# EAGLE schematic A20-OLinuXino-Lime_Rev_J (EAGLE 4.16)
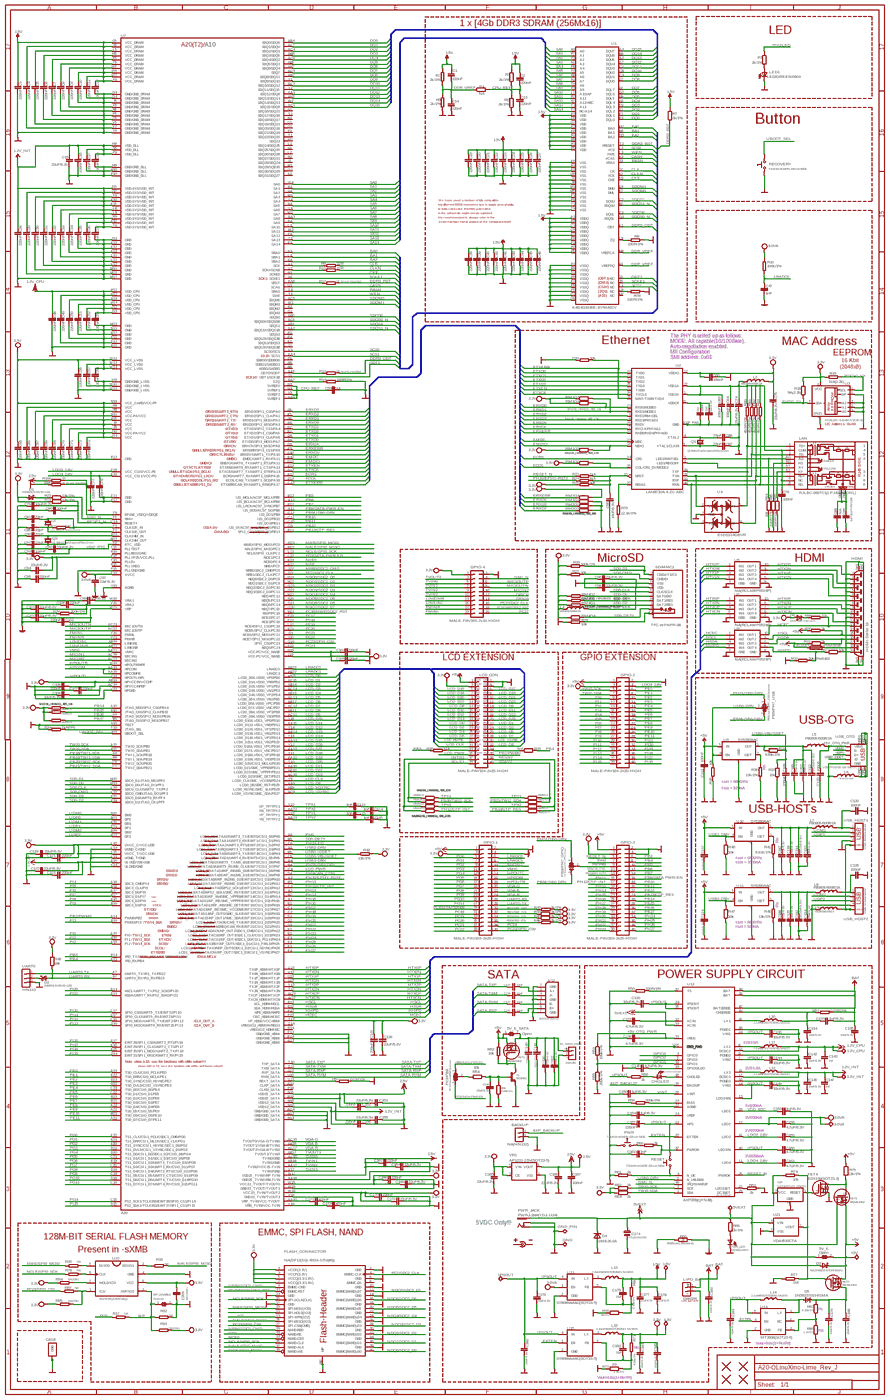
[diagram p0: schematic, sheet 1, overview]
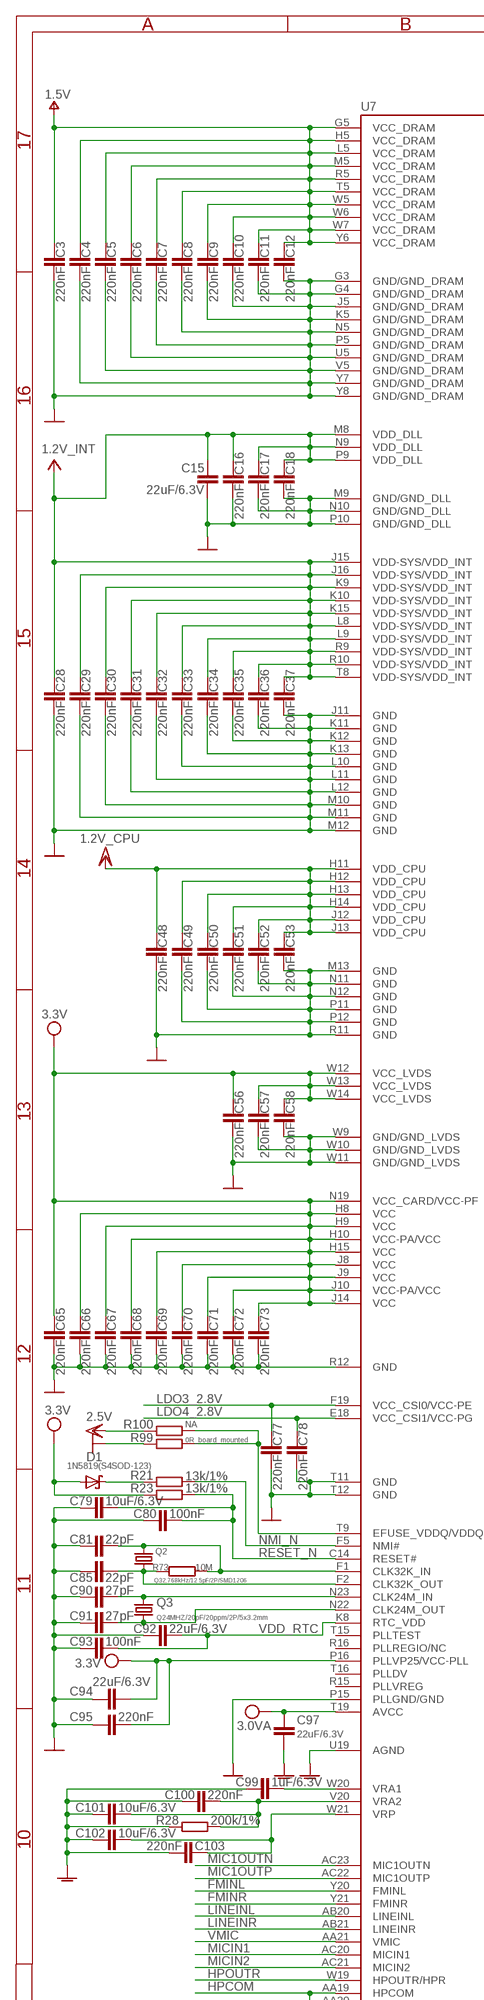
[diagram p1: schematic, sheet 1, part 1 of 4]
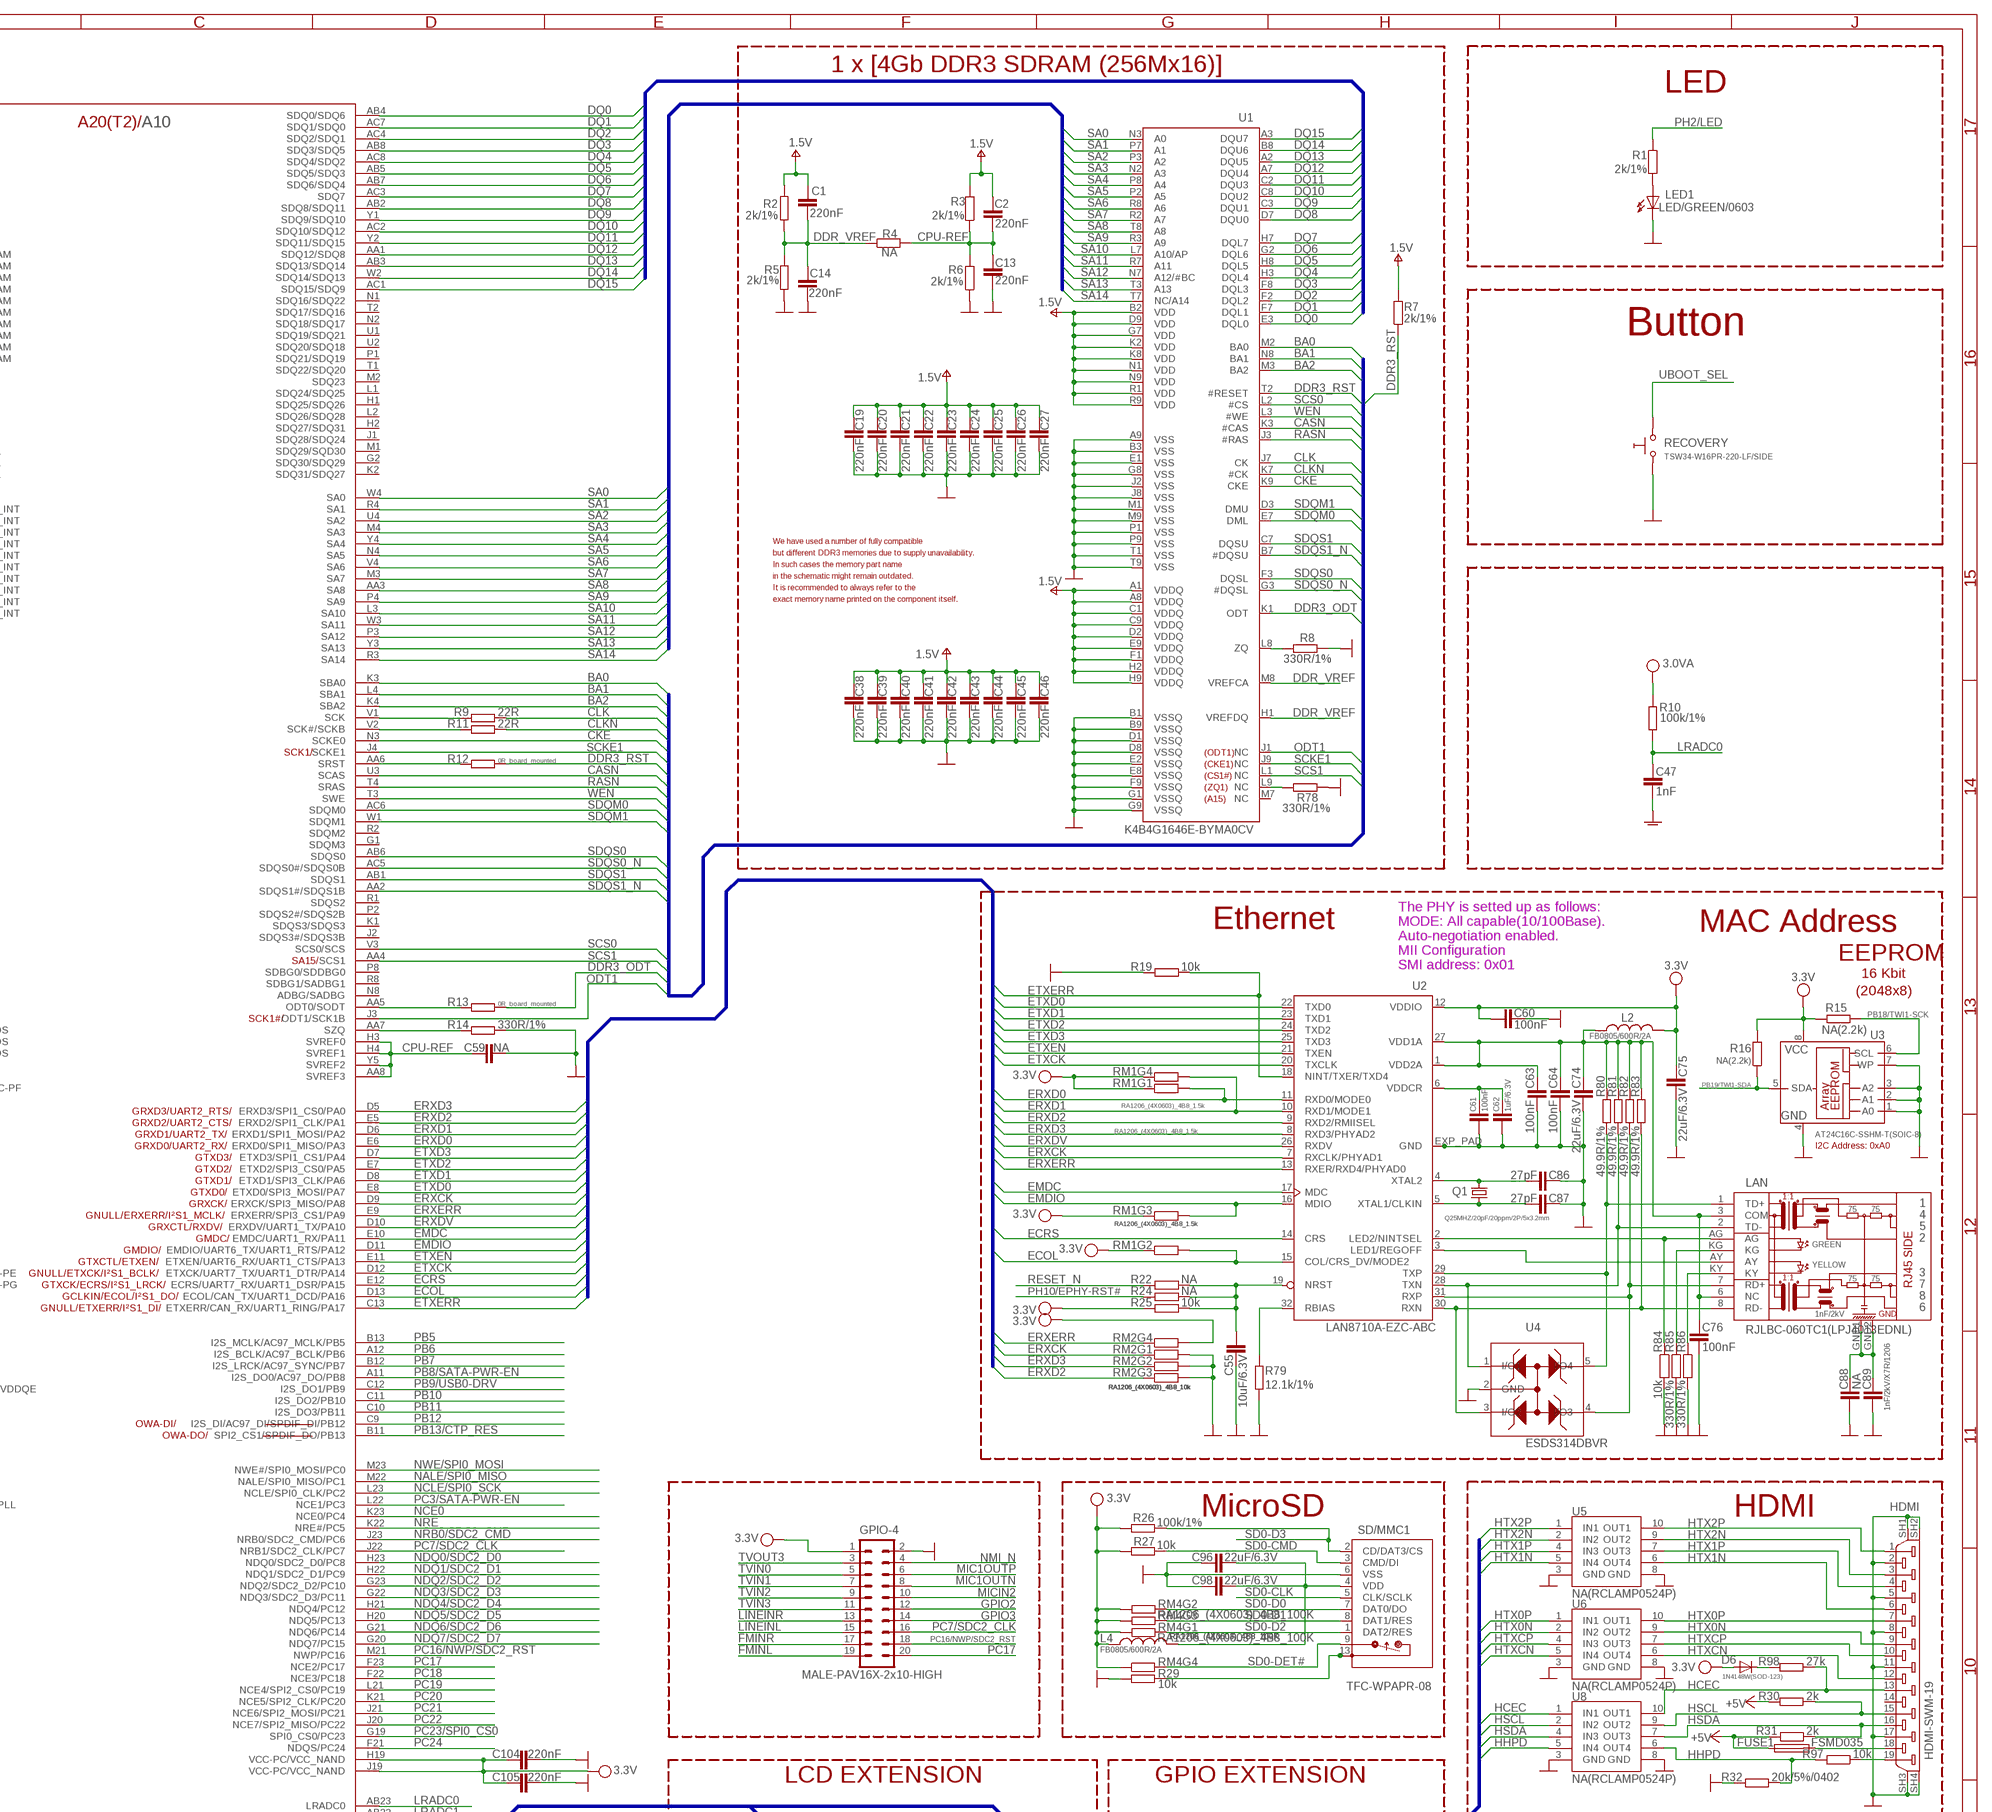
[diagram p2: schematic, sheet 1, part 2 of 4]
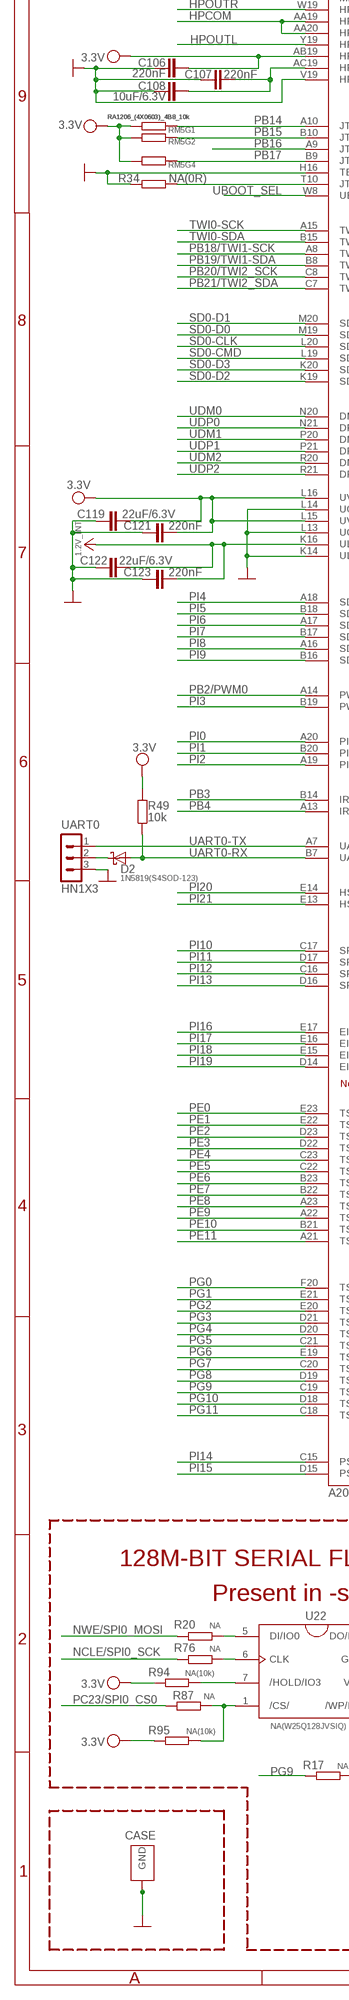
[diagram p3: schematic, sheet 1, part 3 of 4]
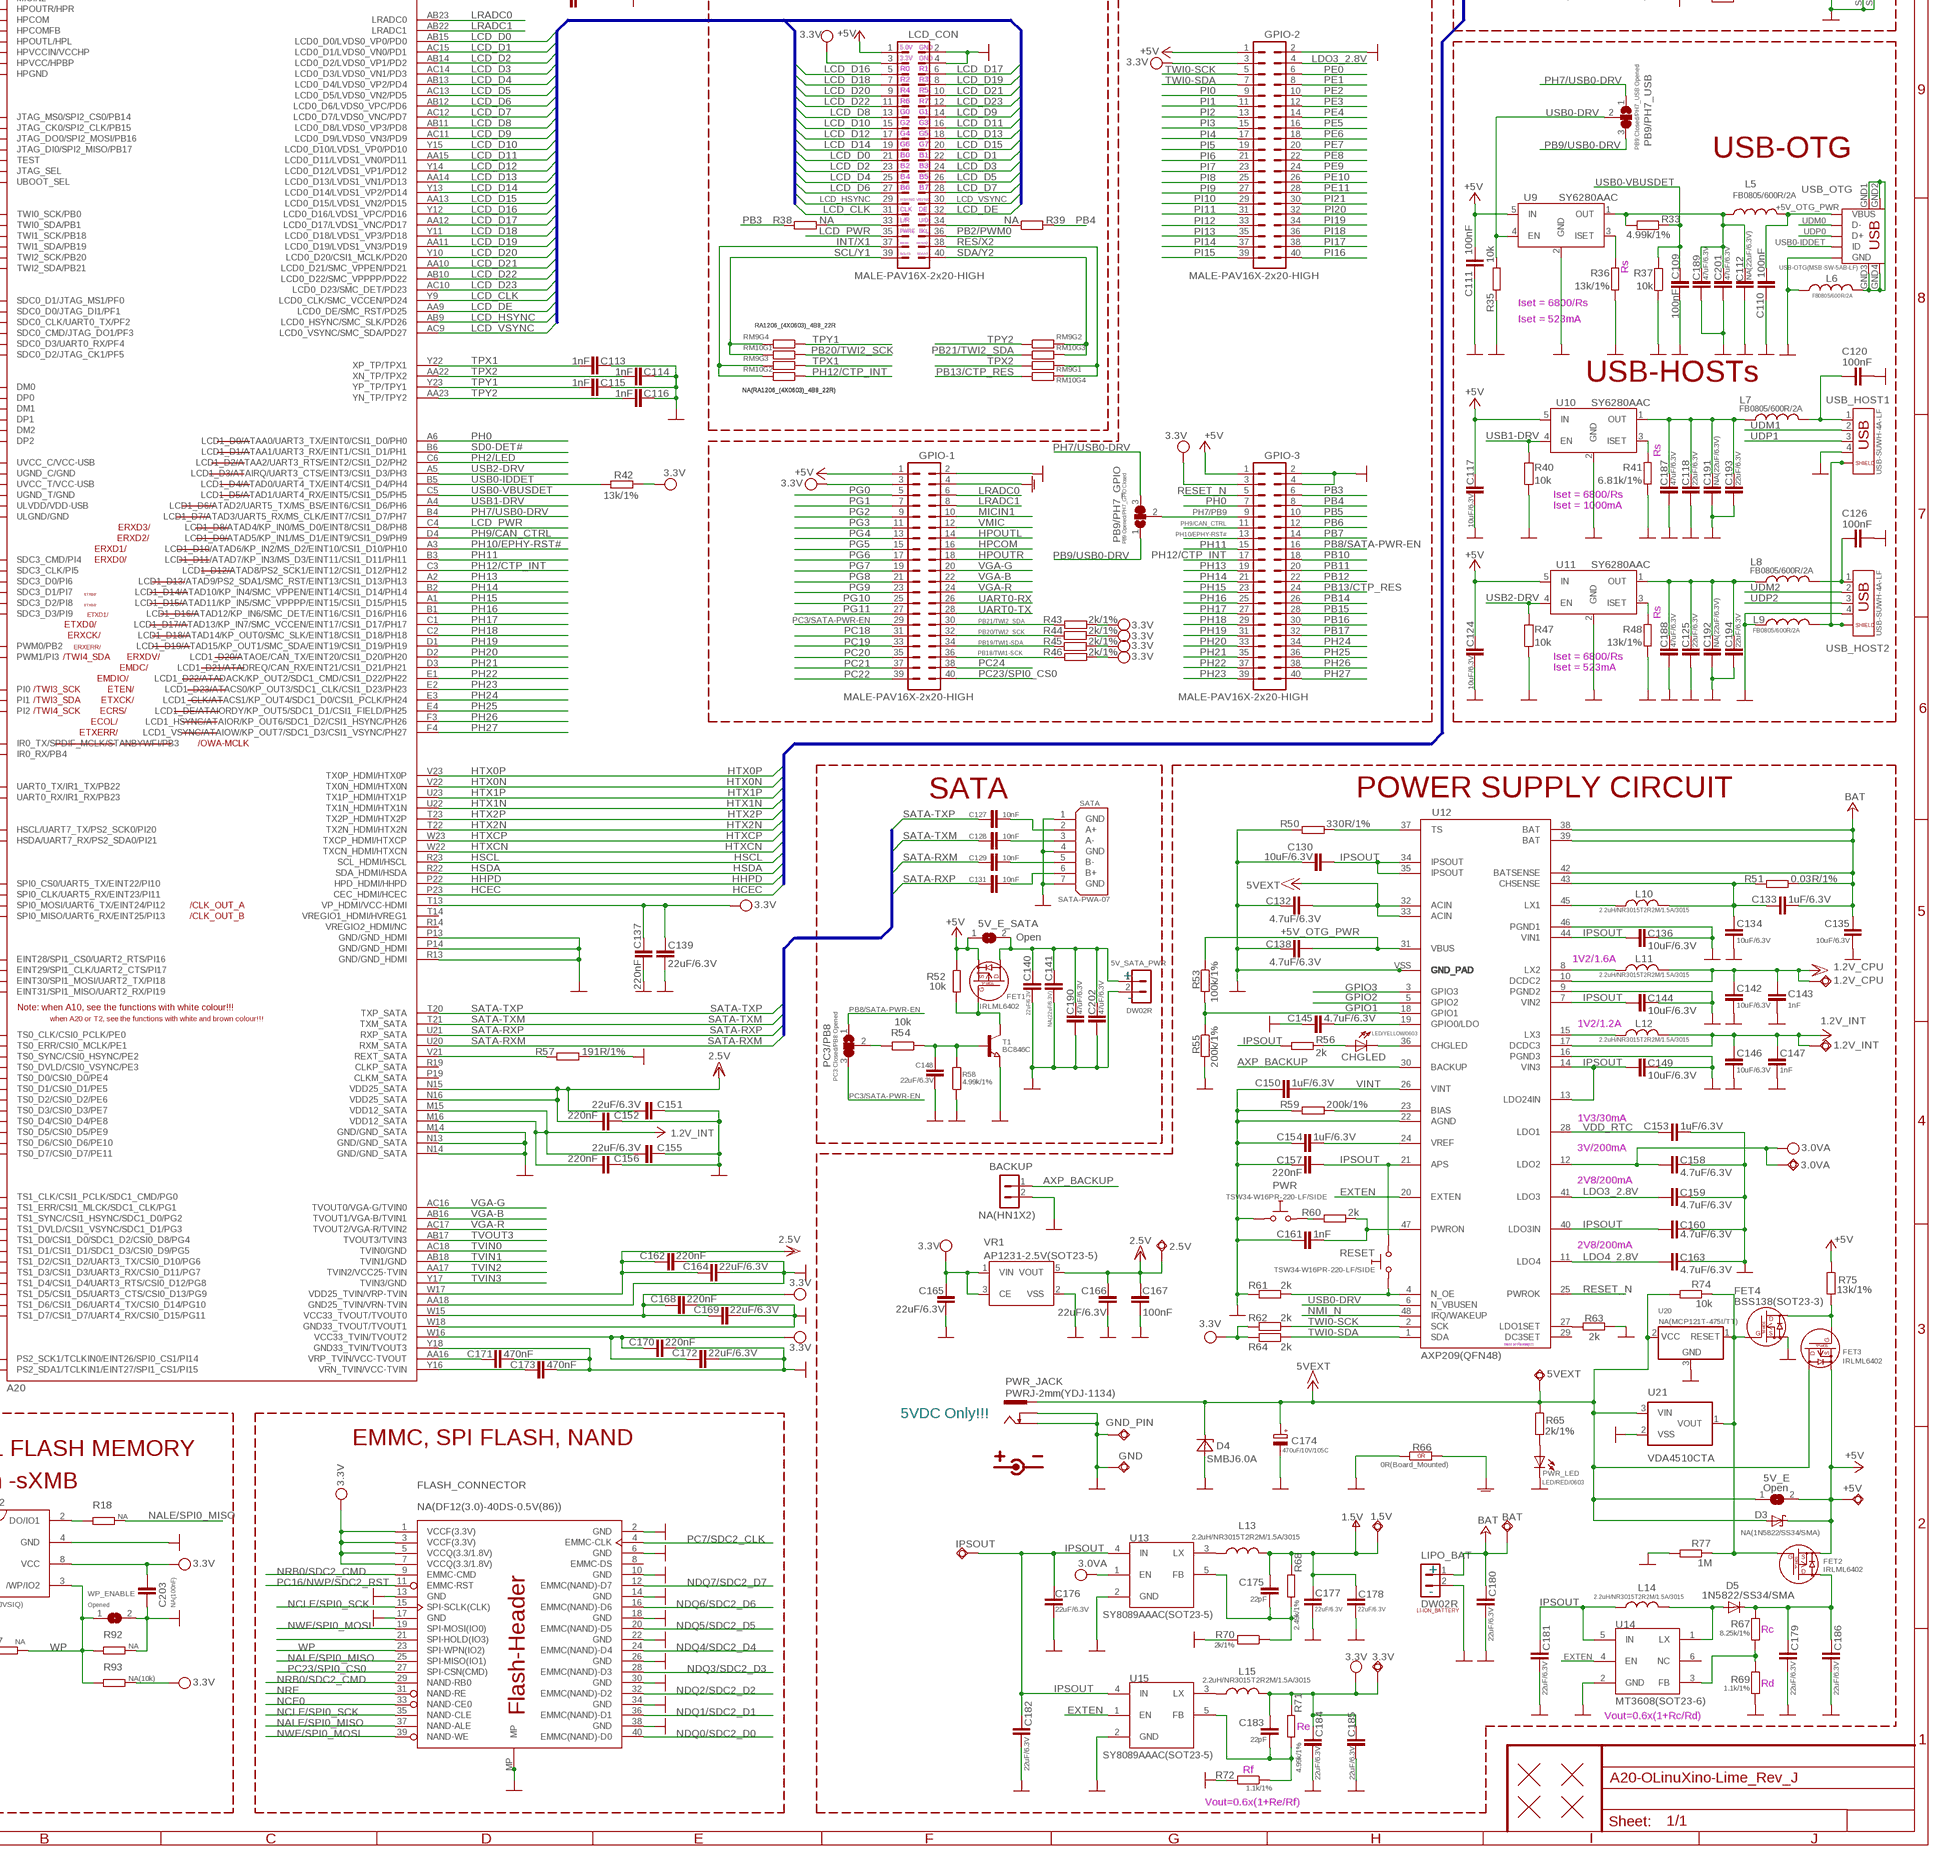
[diagram p4: schematic, sheet 1, part 4 of 4]

## Parts
1.2V_CPU  TESTPADTESTPAD_40-ROUND  [TESTPAD_40-ROUND]
1.2V_INT  TESTPADTESTPAD_40-ROUND  [TESTPAD_40-ROUND]
1.5V  TESTPADTESTPAD_40-ROUND  [TESTPAD_40-ROUND]
2.5V  TESTPADTESTPAD_40-ROUND  [TESTPAD_40-ROUND]
3.0VA  TESTPADTESTPAD_40-ROUND  [TESTPAD_40-ROUND]
3.3V  TESTPADTESTPAD_40-ROUND  [TESTPAD_40-ROUND]
5V_E  Open  SJSJ_SMALLER  [SJ_1_SMALLER]
5V_E_SATA  Open  SJSJ_SMALLER  [SJ_1_SMALLER]
5V_SATA_PWR  DW02R  CON2DW02R  [DW02R]
5VEXT  TESTPADTESTPAD_40-ROUND  [TESTPAD_40-ROUND]
+5V  TESTPADTESTPAD_40-ROUND  [TESTPAD_40-ROUND]
BACKUP  NA(HN1X2)  CON2HN1X2  [HN1X2]
BAT  TESTPADTESTPAD_40-ROUND  [TESTPAD_40-ROUND]
C1  220nF  C-EUC0402_TI  [C0402_TI]
C2  220nF  C-EUC0402_TI  [C0402_TI]
C3  220nF  C-EUC0402_TI  [C0402_TI]
C4  220nF  C-EUC0402_TI  [C0402_TI]
C5  220nF  C-EUC0402_TI  [C0402_TI]
C6  220nF  C-EUC0402_TI  [C0402_TI]
C7  220nF  C-EUC0402_TI  [C0402_TI]
C8  220nF  C-EUC0402_TI  [C0402_TI]
C9  220nF  C-EUC0402_TI  [C0402_TI]
C10  220nF  C-EUC0402_TI  [C0402_TI]
C11  220nF  C-EUC0402_TI  [C0402_TI]
C12  220nF  C-EUC0402_TI  [C0402_TI]
C13  220nF  C-EUC0402_TI  [C0402_TI]
C14  220nF  C-EUC0402_TI  [C0402_TI]
C15  22uF/6.3V  C-EUC0603_DWS  [C0603_DWS]
C16  220nF  C-EUC0402_TI  [C0402_TI]
C17  220nF  C-EUC0402_TI  [C0402_TI]
C18  220nF  C-EUC0402_TI  [C0402_TI]
C19  220nF  C-EUC0402_TI  [C0402_TI]
C20  220nF  C-EUC0402_TI  [C0402_TI]
C21  220nF  C-EUC0402_TI  [C0402_TI]
C22  220nF  C-EUC0402_TI  [C0402_TI]
C23  220nF  C-EUC0402_TI  [C0402_TI]
C24  220nF  C-EUC0402_TI  [C0402_TI]
C25  220nF  C-EUC0402_TI  [C0402_TI]
C26  220nF  C-EUC0402_TI  [C0402_TI]
C27  220nF  C-EUC0402_TI  [C0402_TI]
C28  220nF  C-EUC0402_TI  [C0402_TI]
C29  220nF  C-EUC0402_TI  [C0402_TI]
C30  220nF  C-EUC0402_TI  [C0402_TI]
C31  220nF  C-EUC0402_TI  [C0402_TI]
C32  220nF  C-EUC0402_TI  [C0402_TI]
C33  220nF  C-EUC0402_TI  [C0402_TI]
C34  220nF  C-EUC0402_TI  [C0402_TI]
C35  220nF  C-EUC0402_TI  [C0402_TI]
C36  220nF  C-EUC0402_TI  [C0402_TI]
C37  220nF  C-EUC0402_TI  [C0402_TI]
C38  220nF  C-EUC0402_TI  [C0402_TI]
C39  220nF  C-EUC0402_TI  [C0402_TI]
C40  220nF  C-EUC0402_TI  [C0402_TI]
C41  220nF  C-EUC0402_TI  [C0402_TI]
C42  220nF  C-EUC0402_TI  [C0402_TI]
C43  220nF  C-EUC0402_TI  [C0402_TI]
C44  220nF  C-EUC0402_TI  [C0402_TI]
C45  220nF  C-EUC0402_TI  [C0402_TI]
C46  220nF  C-EUC0402_TI  [C0402_TI]
C47  1nF  C-EUC0402_TI  [C0402_TI]
C48  220nF  C-EUC0402_TI  [C0402_TI]
C49  220nF  C-EUC0402_TI  [C0402_TI]
C50  220nF  C-EUC0402_TI  [C0402_TI]
C51  220nF  C-EUC0402_TI  [C0402_TI]
C52  220nF  C-EUC0402_TI  [C0402_TI]
C53  220nF  C-EUC0402_TI  [C0402_TI]
C55  10uF/6.3V  C-EUC0603_DWS  [C0603_DWS]
C56  220nF  C-EUC0402_TI  [C0402_TI]
C57  220nF  C-EUC0402_TI  [C0402_TI]
C58  220nF  C-EUC0402_TI  [C0402_TI]
C59  NA  C-EUC0603_DWS  [C0603_DWS]
C60  100nF  C-EUC0402_TI  [C0402_TI]
C61  100nF  C-EUC0402_TI  [C0402_TI]
C62  1uF/6.3V  C-EUC0603_DWS  [C0603_DWS]
C63  100nF  C-EUC0402_TI  [C0402_TI]
C64  100nF  C-EUC0402_TI  [C0402_TI]
C65  220nF  C-EUC0402_TI  [C0402_TI]
C66  220nF  C-EUC0402_TI  [C0402_TI]
C67  220nF  C-EUC0402_TI  [C0402_TI]
C68  220nF  C-EUC0402_TI  [C0402_TI]
C69  220nF  C-EUC0402_TI  [C0402_TI]
C70  220nF  C-EUC0402_TI  [C0402_TI]
C71  220nF  C-EUC0402_TI  [C0402_TI]
C72  220nF  C-EUC0402_TI  [C0402_TI]
C73  220nF  C-EUC0402_TI  [C0402_TI]
C74  22uF/6.3V  C-EUC0603_DWS  [C0603_DWS]
C75  22uF/6.3V  C-EUC0603_DWS  [C0603_DWS]
C76  100nF  C-EUC0402_TI  [C0402_TI]
C77  220nF  C-EUC0402_TI  [C0402_TI]
C78  220nF  C-EUC0402_TI  [C0402_TI]
C79  10uF/6.3V  C-EUC0603_DWS  [C0603_DWS]
C80  100nF  C-EUC0402_TI  [C0402_TI]
C81  22pF  C-EUC0603_DWS  [C0603_DWS]
C85  22pF  C-EUC0603_DWS  [C0603_DWS]
C86  27pF  C-EUC0402_TI  [C0402_TI]
C87  27pF  C-EUC0402_TI  [C0402_TI]
C88  NA  C-EUC1206_5MILS_WS_ISO  [C1206_5MILS_WS_ISO]
C89  1nF/2kV/X7R/1206  C-EUC1206_5MILS_WS_ISO  [C1206_5MILS_WS_ISO]
C90  27pF  C-EUC0402_TI  [C0402_TI]
C91  27pF  C-EUC0402_TI  [C0402_TI]
C92  22uF/6.3V  C-EUC0603_DWS  [C0603_DWS]
C93  100nF  C-EUC0402_TI  [C0402_TI]
C94  22uF/6.3V  C-EUC0603_DWS  [C0603_DWS]
C95  220nF  C-EUC0402_TI  [C0402_TI]
C96  22uF/6.3V  C-EUC0603_DWS  [C0603_DWS]
C97  22uF/6.3V  C-EUC0603_DWS  [C0603_DWS]
C98  22uF/6.3V  C-EUC0603_DWS  [C0603_DWS]
C99  1uF/6.3V  C-EUC0603_DWS  [C0603_DWS]
C100  220nF  C-EUC0402_TI  [C0402_TI]
C101  10uF/6.3V  C-EUC0603_DWS  [C0603_DWS]
C102  10uF/6.3V  C-EUC0603_DWS  [C0603_DWS]
C103  220nF  C-EUC0402_TI  [C0402_TI]
C104  220nF  C-EUC0402_TI  [C0402_TI]
C105  220nF  C-EUC0402_TI  [C0402_TI]
C106  220nF  C-EUC0402_TI  [C0402_TI]
C107  220nF  C-EUC0402_TI  [C0402_TI]
C108  10uF/6.3V  C-EUC0603_DWS  [C0603_DWS]
C109  100nF  C-EUC0402_TI  [C0402_TI]
C110  100nF  C-EUC0402_TI  [C0402_TI]
C111  100nF  C-EUC0402_TI  [C0402_TI]
C112  NA(22uF/6.3V)  C-EUC0603_DWS  [C0603_DWS]
C113  1nF  C-EUC0402_TI  [C0402_TI]
C114  1nF  C-EUC0402_TI  [C0402_TI]
C115  1nF  C-EUC0402_TI  [C0402_TI]
C116  1nF  C-EUC0402_TI  [C0402_TI]
C117  10uF/6.3V  C-EUC0603_DWS  [C0603_DWS]
C118  22uF/6.3V  C-EUC0603_DWS  [C0603_DWS]
C119  22uF/6.3V  C-EUC0603_DWS  [C0603_DWS]
C120  100nF  C-EUC0402_TI  [C0402_TI]
C121  220nF  C-EUC0402_TI  [C0402_TI]
C122  22uF/6.3V  C-EUC0603_DWS  [C0603_DWS]
C123  220nF  C-EUC0402_TI  [C0402_TI]
C124  10uF/6.3V  C-EUC0603_DWS  [C0603_DWS]
C125  22uF/6.3V  C-EUC0603_DWS  [C0603_DWS]
C126  100nF  C-EUC0402_TI  [C0402_TI]
C127  10nF  C-EUC0402_TI  [C0402_TI]
C128  10nF  C-EUC0402_TI  [C0402_TI]
C129  10nF  C-EUC0402_TI  [C0402_TI]
C130  10uF/6.3V  C-EUC0603_DWS  [C0603_DWS]
C131  10nF  C-EUC0402_TI  [C0402_TI]
C132  4.7uF/6.3V  C-EUC0603_DWS  [C0603_DWS]
C133  1uF/6.3V  C-EUC0603_DWS  [C0603_DWS]
C134  10uF/6.3V  C-EUC0603_DWS  [C0603_DWS]
C135  10uF/6.3V  C-EUC0603_DWS  [C0603_DWS]
C136  10uF/6.3V  C-EUC0603_DWS  [C0603_DWS]
C137  220nF  C-EUC0402_TI  [C0402_TI]
C138  4.7uF/6.3V  C-EUC0603_DWS  [C0603_DWS]
C139  22uF/6.3V  C-EUC0603_DWS  [C0603_DWS]
C140  22uF/6.3V  C-EUC0603_DWS  [C0603_DWS]
C141  NA(22uF/6.3V)  C-EUC0603_DWS  [C0603_DWS]
C142  10uF/6.3V  C-EUC0603_DWS  [C0603_DWS]
C143  1nF  C-EUC0402_TI  [C0402_TI]
C144  10uF/6.3V  C-EUC0603_DWS  [C0603_DWS]
C145  4.7uF/6.3V  C-EUC0603_DWS  [C0603_DWS]
C146  10uF/6.3V  C-EUC0603_DWS  [C0603_DWS]
C147  1nF  C-EUC0402_TI  [C0402_TI]
C148  22uF/6.3V  C-EUC0603_DWS  [C0603_DWS]
C149  10uF/6.3V  C-EUC0603_DWS  [C0603_DWS]
C150  1uF/6.3V  C-EUC0603_DWS  [C0603_DWS]
C151  22uF/6.3V  C-EUC0603_DWS  [C0603_DWS]
C152  220nF  C-EUC0402_TI  [C0402_TI]
C153  1uF/6.3V  C-EUC0603_DWS  [C0603_DWS]
C154  1uF/6.3V  C-EUC0603_DWS  [C0603_DWS]
C155  22uF/6.3V  C-EUC0603_DWS  [C0603_DWS]
C156  220nF  C-EUC0402_TI  [C0402_TI]
C157  220nF  C-EUC0402_TI  [C0402_TI]
C158  4.7uF/6.3V  C-EUC0603_DWS  [C0603_DWS]
C159  4.7uF/6.3V  C-EUC0603_DWS  [C0603_DWS]
C160  4.7uF/6.3V  C-EUC0603_DWS  [C0603_DWS]
C161  1nF  C-EUC0402_TI  [C0402_TI]
C162  220nF  C-EUC0402_TI  [C0402_TI]
C163  4.7uF/6.3V  C-EUC0603_DWS  [C0603_DWS]
C164  22uF/6.3V  C-EUC0603_DWS  [C0603_DWS]
C165  22uF/6.3V  C-EUC0603_DWS  [C0603_DWS]
C166  22uF/6.3V  C-EUC0603_DWS  [C0603_DWS]
C167  100nF  C-EUC0402_TI  [C0402_TI]
C168  220nF  C-EUC0402_TI  [C0402_TI]
C169  22uF/6.3V  C-EUC0603_DWS  [C0603_DWS]
C170  220nF  C-EUC0402_TI  [C0402_TI]
C171  470nF  C-EUC0603_DWS  [C0603_DWS]
C172  22uF/6.3V  C-EUC0603_DWS  [C0603_DWS]
C173  470nF  C-EUC0603_DWS  [C0603_DWS]
C174  470uF/10V/105C  CPOL-EUE2.5-6.3  [E2,5-6,3]
C175  22pF  C-EUC0603_DWS  [C0603_DWS]
C176  22uF/6.3V  C-EUC0603_DWS  [C0603_DWS]
C177  22uF/6.3V  C-EUC0603_DWS  [C0603_DWS]
C178  22uF/6.3V  C-EUC0603_DWS  [C0603_DWS]
C179  22uF/6.3V  C-EUC0603_DWS  [C0603_DWS]
C180  22uF/6.3V  C-EUC0603_DWS  [C0603_DWS]
C181  22uF/6.3V  C-EUC0603_DWS  [C0603_DWS]
C182  22uF/6.3V  C-EUC0603_DWS  [C0603_DWS]
C183  22pF  C-EUC0603_DWS  [C0603_DWS]
C184  22uF/6.3V  C-EUC0603_DWS  [C0603_DWS]
C185  22uF/6.3V  C-EUC0603_DWS  [C0603_DWS]
C186  22uF/6.3V  C-EUC0603_DWS  [C0603_DWS]
C187  47uF/6.3V  C-EUC0805_5MIL_D  [C0805_5MIL_D]
C188  47uF/6.3V  C-EUC0805_5MIL_D  [C0805_5MIL_D]
C189  47uF/6.3V  C-EUC0805_5MIL_D  [C0805_5MIL_D]
C190  47uF/6.3V  C-EUC0805_5MIL_D  [C0805_5MIL_D]
C191  NA(22uF/6.3V)  C-EUC0603_DWS  [C0603_DWS]
C192  NA(22uF/6.3V)  C-EUC0603_DWS  [C0603_DWS]
C193  22uF/6.3V  C-EUC0603_DWS  [C0603_DWS]
C194  22uF/6.3V  C-EUC0603_DWS  [C0603_DWS]
C201  47uF/6.3V  C-EUC0805_5MIL_D  [C0805_5MIL_D]
C202  47uF/6.3V  C-EUC0805_5MIL_D  [C0805_5MIL_D]
C203  NA(100nF)  C-EUC0402_TI  [C0402_TI]
CASE  CASE_HAMMOND_1593LBK-1  [HAMMOND_1593LBK_A10_LIME_NO_MILLING]
CHGLED  LED/YELLOW/0603  LEDLED-0603_TEST  [LED-0603_TEST]
D1  1N5819(S4SOD-123)  SCHOTKKY7.62SS-1N5819(S4SOD-123)  [SOD-123]
D2  1N5819(S4SOD-123)  SCHOTKKY7.62SS-1N5819(S4SOD-123)  [SOD-123]
D3  NA(1N5822/SS34/SMA)  SCHOTKKY7.62SS2  [MLL-41]
D4  SMBJ6.0A  SMBJ16A  [DO214AA]
D5  1N5822/SS34/SMA  D-MLL-41  [MELF-MLL41]
D6  1N4148W(SOD-123)  DSMD  [MINI-MELF]
FET1  IRLML6402  P-MOS+DIODIRLML6402  [SOT23]
FET2  IRLML6402  P-MOS+DIODIRLML6402  [SOT23]
FET3  IRLML6402  P-MOS+DIODIRLML6402  [SOT23]
FET4  BSS138(SOT23-3)  N-MOS+DIODBSS138(SOT23-3)  [SOT23]
FLASH_CONNECTOR  NA(DF12(3.0)-40DS-0.5V(86))  FLASH_CON[DF12(3.0)-40DS-0.5V(86)]  [FLASH_CON[DF12(3.0)-40DS-0.5V(86)]]
FUSE1  FSMD035  FUSE  [1206]
GND  TESTPADTESTPAD_40-ROUND  [TESTPAD_40-ROUND]
GND_PIN  TESTPAD3  [TEST_PAD40/70/SQUARE]
GPIO-1  MALE-PAV16X-2x20-HIGH  ML40YA-V36P-2X20-LF  [YA-V36P-2X20-LF]
GPIO-2  MALE-PAV16X-2x20-HIGH  ML40YA-V36P-2X20-LF  [YA-V36P-2X20-LF]
GPIO-3  MALE-PAV16X-2x20-HIGH  ML40YA-V36P-2X20-LF  [YA-V36P-2X20-LF]
GPIO-4  MALE-PAV16X-2x10-HIGH  ML20YA-V36P-2X10-LF  [YA-V36P-2X10-LF]
HDMI  HDMI-SWM-19  HDMI-MC34931HDMI-SWM-19-OLD  [HDMI-SWM-19-OLD]
IPSOUT  TESTPADTESTPAD_40-ROUND  [TESTPAD_40-ROUND]
L2  FB0805/600R/2A  L-USL0805_5MIL_DWS  [L0805_5MIL_DWS]
L4  FB0805/600R/2A  L-USL0805_5MIL_DWS  [L0805_5MIL_DWS]
L5  FB0805/600R/2A  L-USL0805_5MIL_DWS  [L0805_5MIL_DWS]
L6  FB0805/600R/2A  L-USL0805_5MIL_DWS  [L0805_5MIL_DWS]
L7  FB0805/600R/2A  L-USL0805_5MIL_DWS  [L0805_5MIL_DWS]
L8  FB0805/600R/2A  L-USL0805_5MIL_DWS  [L0805_5MIL_DWS]
L9  FB0805/600R/2A  L-USL0805_5MIL_DWS  [L0805_5MIL_DWS]
L10  2.2uH/NR3015T2R2M/1.5A/3015  L-CD32  [CD32]
L11  2.2uH/NR3015T2R2M/1.5A/3015  L-CD32  [CD32]
L12  2.2uH/NR3015T2R2M/1.5A/3015  L-CD32  [CD32]
L13  2.2uH/NR3015T2R2M/1.5A/3015  L-CD32  [CD32]
L14  2.2uH/NR3015T2R2M/1.5A/3015  L-CD32  [CD32]
L15  2.2uH/NR3015T2R2M/1.5A/3015  L-CD32  [CD32]
LAN  RJLBC-060TC1(LPJ4013EDNL)  RJLBC-060TC1_GND_MILLING  [RJLBC-060TC1_MILLING]
LCD_CON  MALE-PAV16X-2x20-HIGH  ML40YA-V36P-2X20-LF  [YA-V36P-2X20-LF]
LED1  LED/GREEN/0603  LEDLED-0603_TEST  [LED-0603_TEST]
LIPO_BAT  DW02R  CON2DW02R  [DW02R]
PB9/PH7_GPIO  PB9:Opened/PH7_GPIO:Closed  SJ2W5  [SJ_2_SMALL_23_TIED]
PB9/PH7_USB  PB9:Closed/PH7_USB:Opened  SJ2W5  [SJ_2_SMALL_23_TIED]
PC3/PB8  PC3:Closed/PB8:Opened  SJ2W5  [SJ_2_SMALL_23_TIED]
PWR  TSW34-W16PR-220-LF/SIDE  SW-TAKTSIDE_WTCM-TR(3X4)  [SW_TAKT3X4]
PWR_JACK  PWRJ-2mm(YDJ-1134)  PWR-JAKPWR_JACK_UNI_MILLING  [PWR_JACK_UNI_MILLING]
PWR_LED  LED/RED/0603  LEDLED-0603_TEST  [LED-0603_TEST]
Q1  Q25MHZ/20pF/20ppm/2P/5x3.2mm  HC49/STEST  [HCX-4S_TEST]
Q2  Q32.768kHz/12.5pF/2P/SMD1206  MC-306_MC-306-TEST  [MC-306_TEST]
Q3  Q24MHZ/20pF/20ppm/2P/5x3.2mm  HC49/STEST  [HCX-4S_TEST]
R1  2k/1%  R-EU_R0603_5MIL_DWS  [R0603_5MIL_DWS]
R2  2k/1%  R-EU_R0603_5MIL_DWS  [R0603_5MIL_DWS]
R3  2k/1%  R-EU_R0603_5MIL_DWS  [R0603_5MIL_DWS]
R4  NA  R-EU_R0603_5MIL_DWS  [R0603_5MIL_DWS]
R5  2k/1%  R-EU_R0603_5MIL_DWS  [R0603_5MIL_DWS]
R6  2k/1%  R-EU_R0603_5MIL_DWS  [R0603_5MIL_DWS]
R7  2k/1%  R-EU_R0603_5MIL_DWS  [R0603_5MIL_DWS]
R8  330R/1%  R-EU_R0603_5MIL_DWS  [R0603_5MIL_DWS]
R9  22R  R-EU_R0402_TI  [R0402_TI]
R10  100k/1%  R-EU_R0603_5MIL_DWS  [R0603_5MIL_DWS]
R11  22R  R-EU_R0402_TI  [R0402_TI]
R12  0R_board_mounted  R-EU_R0402_TI_0R  [R0402_TI_0R]
R13  0R_board_mounted  R-EU_R0402_TI_0R  [R0402_TI_0R]
R14  330R/1%  R-EU_R0603_5MIL_DWS  [R0603_5MIL_DWS]
R15  NA(2.2k)  R-EU_R0603_5MIL_DWS  [R0603_5MIL_DWS]
R16  NA(2.2k)  R-EU_R0603_5MIL_DWS  [R0603_5MIL_DWS]
R17  NA  R-EU_R0402_TI  [R0402_TI]
R18  NA  R-EU_R0402_TI  [R0402_TI]
R19  10k  R-EU_R0402_TI  [R0402_TI]
R20  NA  R-EU_R0402_TI  [R0402_TI]
R21  13k/1%  R-EU_R0603_5MIL_DWS  [R0603_5MIL_DWS]
R22  NA  R-EU_R0402_TI  [R0402_TI]
R23  13k/1%  R-EU_R0603_5MIL_DWS  [R0603_5MIL_DWS]
R24  NA  R-EU_R0402_TI  [R0402_TI]
R25  10k  R-EU_R0402_TI  [R0402_TI]
R26  100k/1%  R-EU_R0603_5MIL_DWS  [R0603_5MIL_DWS]
R27  10k  R-EU_R0402_TI  [R0402_TI]
R28  200k/1%  R-EU_R0603_5MIL_DWS  [R0603_5MIL_DWS]
R29  10k  R-EU_R0402_TI  [R0402_TI]
R30  2k  R-EU_R0402_TI  [R0402_TI]
R31  2k  R-EU_R0402_TI  [R0402_TI]
R32  20k/5%/0402  R-EU_R0402_TI  [R0402_TI]
R33  4.99k/1%  R-EU_R0603_5MIL_DWS  [R0603_5MIL_DWS]
R34  NA(0R)  R-EU_R0603_5MIL_DWS  [R0603_5MIL_DWS]
R35  10k  R-EU_R0402_TI  [R0402_TI]
R36  13k/1%  R-EU_R0603_5MIL_DWS  [R0603_5MIL_DWS]
R37  10k  R-EU_R0402_TI  [R0402_TI]
R38  NA  R-EU_R0603_5MIL_DWS  [R0603_5MIL_DWS]
R39  NA  R-EU_R0603_5MIL_DWS  [R0603_5MIL_DWS]
R40  10k  R-EU_R0402_TI  [R0402_TI]
R41  6.81k/1%  R-EU_R0603_5MIL_DWS  [R0603_5MIL_DWS]
R42  13k/1%  R-EU_R0603_5MIL_DWS  [R0603_5MIL_DWS]
R43  2k/1%  R-EU_R0603_5MIL_DWS  [R0603_5MIL_DWS]
R44  2k/1%  R-EU_R0603_5MIL_DWS  [R0603_5MIL_DWS]
R45  2k/1%  R-EU_R0603_5MIL_DWS  [R0603_5MIL_DWS]
R46  2k/1%  R-EU_R0603_5MIL_DWS  [R0603_5MIL_DWS]
R47  10k  R-EU_R0402_TI  [R0402_TI]
R48  13k/1%  R-EU_R0603_5MIL_DWS  [R0603_5MIL_DWS]
R49  10k  R-EU_R0402_TI  [R0402_TI]
R50  330R/1%  R-EU_R0603_5MIL_DWS  [R0603_5MIL_DWS]
R51  0.03R/1%  R-EU_R1206_5MIL_WS  [R1206_5MIL_WS]
R52  10k  R-EU_R0402_TI  [R0402_TI]
R53  100k/1%  R-EU_R0603_5MIL_DWS  [R0603_5MIL_DWS]
R54  10k  R-EU_R0402_TI  [R0402_TI]
R55  200k/1%  R-EU_R0603_5MIL_DWS  [R0603_5MIL_DWS]
R56  2k  R-EU_R0402_TI  [R0402_TI]
R57  191R/1%  R-EU_R0603_5MIL_DWS  [R0603_5MIL_DWS]
R58  4.99k/1%  R-EU_R0603_5MIL_DWS  [R0603_5MIL_DWS]
R59  200k/1%  R-EU_R0603_5MIL_DWS  [R0603_5MIL_DWS]
R60  2k  R-EU_R0402_TI  [R0402_TI]
R61  2k  R-EU_R0402_TI  [R0402_TI]
R62  2k  R-EU_R0402_TI  [R0402_TI]
R63  2k  R-EU_R0402_TI  [R0402_TI]
R64  2k  R-EU_R0402_TI  [R0402_TI]
R65  2k/1%  R-EU_R0603_5MIL_DWS  [R0603_5MIL_DWS]
R66  0R(Board_Mounted)  R_0R0R(NA)  [0603_0R]
R67  8.25k/1%  R-EU_R0603_5MIL_DWS  [R0603_5MIL_DWS]
R68  2.49k/1%  R-EU_R0603_5MIL_DWS  [R0603_5MIL_DWS]
R69  1.1k/1%  R-EU_R0603_5MIL_DWS  [R0603_5MIL_DWS]
R70  2k/1%  R-EU_R0603_5MIL_DWS  [R0603_5MIL_DWS]
R71  4.99k/1%  R-EU_R0603_5MIL_DWS  [R0603_5MIL_DWS]
R72  1.1k/1%  R-EU_R0603_5MIL_DWS  [R0603_5MIL_DWS]
R73  10M  R-EU_R0402_TI  [R0402_TI]
R74  10k  R-EU_R0402_TI  [R0402_TI]
R75  13k/1%  R-EU_R0603_5MIL_DWS  [R0603_5MIL_DWS]
R76  NA  R-EU_R0402_TI  [R0402_TI]
R77  1M  R-EU_R0402_TI  [R0402_TI]
R78  330R/1%  R-EU_R0603_5MIL_DWS  [R0603_5MIL_DWS]
R79  12.1k/1%  R-EU_R0603_5MIL_DWS  [R0603_5MIL_DWS]
R80  49.9R/1%  R-EU_R0402_TI  [R0402_TI]
R81  49.9R/1%  R-EU_R0402_TI  [R0402_TI]
R82  49.9R/1%  R-EU_R0402_TI  [R0402_TI]
R83  49.9R/1%  R-EU_R0402_TI  [R0402_TI]
R84  10k  R-EU_R0402_TI  [R0402_TI]
R85  330R/1%  R-EU_R0603_5MIL_DWS  [R0603_5MIL_DWS]
R86  330R/1%  R-EU_R0603_5MIL_DWS  [R0603_5MIL_DWS]
R87  NA  R-EU_R0402_TI  [R0402_TI]
R92  NA  R-EU_R0402_TI  [R0402_TI]
R93  NA(10k)  R-EU_R0402_TI  [R0402_TI]
R94  NA(10k)  R-EU_R0402_TI  [R0402_TI]
R95  NA(10k)  R-EU_R0402_TI  [R0402_TI]
R97  10k  R-EU_R0402_TI  [R0402_TI]
R98  27k  R-EU_R0402_TI  [R0402_TI]
R99  0R_board_mounted  R-EU_R0402_TI_0R  [R0402_TI_0R]
R100  NA  R-EU_R0402_TI  [R0402_TI]
RECOVERY  TSW34-W16PR-220-LF/SIDE  SW-TAKTSIDE_WTCM-TR(3X4)  [SW_TAKT3X4]
RESET  TSW34-W16PR-220-LF/SIDE  SW-TAKTSIDE_WTCM-TR(3X4)  [SW_TAKT3X4]
RM1  RA1206_(4X0603)_4B8_1.5k  R_MATRIX_4E  [R_MATRIX_4]
RM2  RA1206_(4X0603)_4B8_10k  R_MATRIX_4E  [R_MATRIX_4]
RM4  RA1206_(4X0603)_4B8_100K  R_MATRIX_4E  [R_MATRIX_4]
RM5  RA1206_(4X0603)_4B8_10k  R_MATRIX_4E  [R_MATRIX_4]
RM9  RA1206_(4X0603)_4B8_22R  R_MATRIX_4E  [R_MATRIX_4]
RM10  NA(RA1206_(4X0603)_4B8_22R)  R_MATRIX_4E  [R_MATRIX_4]
SATA  SATA-PWA-07  SATA-PWA-07"  [SATA-PWA-07]
SD/MMC1  TFC-WPAPR-08  MICRO_SD/MMC_CP_NEWTFC-WPAPR-08  [TFC-WPAPR-08]
T1  BC846C  NPN-TRANSISTOR_SOT23  [SOT23]
U1  K4B4G1646E-BYMA0CV  H5TQ2G63BFR_MEM4G16D3EABG-125PHIS  [FBGA96_MEM]
U2  LAN8710A-EZC-ABC  LAN8710A-EZC  [QFN-32(DRILLS)]
U3  AT24C16C-SSHM-T(SOIC-8)  24LCXX  [SO-08MN]
U4  ESDS314DBVR  [SOT23-5]
U5  NA(RCLAMP0524P)  RCLAMP0524PTEST  [SLP2510P8_TEST]
U6  NA(RCLAMP0524P)  RCLAMP0524PTEST  [SLP2510P8_TEST]
U7  A20  A10  [TFBGA441]
U8  NA(RCLAMP0524P)  RCLAMP0524PTEST  [SLP2510P8_TEST]
U9  SY6280AAC  SY6280  [SOT23-5]
U10  SY6280AAC  SY6280  [SOT23-5]
U11  SY6280AAC  SY6280  [SOT23-5]
U12  AXP209(QFN48)  AXP209  [QFN48]
U13  SY8089AAAC(SOT23-5)  SY8008  [SOT23-5]
U14  MT3608(SOT23-6)  SY7208  [SOT23-6]
U15  SY8089AAAC(SOT23-5)  SY8008  [SOT23-5]
U16  FIDUCIAL  [FIDUCIAL-1X3]
U17  FIDUCIAL  [FIDUCIAL-1X3]
U18  FIDUCIAL  [FIDUCIAL-1X3]
U19  FIDUCIAL  [FIDUCIAL-1X3]
U20  NA(MCP121T-475I/TT)  RESETMCP130T-300-I/TT  [SOT23]
U21  VDA4510CTA  VDA2710NTA  [SOT-23]
U22  NA(W25Q128JVSIQ)  W25Q16BVSSIG(SO-8)  [SO-8-BIG]
UART0  HN1X3  CON3HN1X3  [HN1X3]
USB_HOST1  USB-SUWH-4A-LF  USB_SHIELDUSB_A_VERTICAL  [USB_A_VERTICAL_PTH]
USB_HOST2  USB-SUWH-4A-LF  USB_SHIELDUSB_A_VERTICAL  [USB_A_VERTICAL_PTH]
USB_OTG  USB-OTG(MSB-SW-5AB-LF)  MINI_USB9-USB-OTG(MSB-SW-5AB-LF)  [USB_MINI_9PIN-SD]
VR1  AP1231-2.5V(SOT23-5)  AP1231-33  [SOT-23-5]
WP_ENABLE  Opened  SJSJ_SMALLER  [SJ_1_SMALLER]

## Nets
+5V: 5V_E.2 5V_E_SATA.1 +5V.1(PP) C111.1 C117.1 C124.1 D3.K(C) FET1.2(S) FET2.2(S) FET3.2(S) FUSE1.1 GPIO-1.1 GPIO-2.1 GPIO-3.1 LCD_CON.1 R30.2 R31.2 R52.1 R75.1 U9.5(IN) U10.5(IN) U11.5(IN)
+5V_OTG_PWR: C110.1 C138.2 L5.1 R53.1 U12.31(VBUS) USB_OTG.VBUS
+15V: 5V_E.1 5VEXT.1(PP) C132.2 C174.+ D3.A D4.C FET3.3(D) PWR_JACK.+ R65.1 R74.1 U12.32(ACIN) U12.33(ACIN) U20.2(VCC) U21.3(VIN) ; supply symbol labelled 5VEXT
+24V: BAT.1(PP) C133.2 C135.1 C180.2 LIPO_BAT.1 R51.2 U12.38(BAT) U12.39(BAT) U12.42(BATSENSE) ; supply symbol labelled BAT
AXP_BACKUP: BACKUP.1 U12.30(BACKUP)
BA0: U1.M2(BA0) U7.K3(SBA0)
BA1: U1.N8(BA1) U7.L4(SBA1)
BA2: U1.M3(BA2) U7.K4(SBA2)
CASN: U1.K3(#CAS) U7.U3(SCAS)
CHASSIS [PWR]: C88.2 C89.2 LAN.GND1 LAN.GND2
CKE: U1.K9(CKE) U7.N3(SCKE0)
CLK: R9.1 U1.J7(CK)
CLKN: R11.1 U1.K7(#CK)
CPU-REF: C2.2 C13.2 C59.2 R3.1 R4.2 R6.2 U7.AA8(SVREF3) U7.H3(SVREF0) U7.H4(SVREF1) U7.Y5(SVREF2)
DDR3_ODT: R13.1 U1.K1(ODT)
DDR3_RST: R7.1 R12.1 U1.T2(#RESET)
DDR_VREF: C1.2 C14.2 R2.1 R4.1 R5.2 U1.H1(VREFDQ) U1.M8(VREFCA)
DQ0: U1.E3(DQL0) U7.AB4(SDQ0/SDQ6)
DQ1: U1.F7(DQL1) U7.AC7(SDQ1/SDQ0)
DQ2: U1.F2(DQL2) U7.AC4(SDQ2/SDQ1)
DQ3: U1.F8(DQL3) U7.AB8(SDQ3/SDQ5)
DQ4: U1.H3(DQL4) U7.AC8(SDQ4/SDQ2)
DQ5: U1.H8(DQL5) U7.AB5(SDQ5/SDQ3)
DQ6: U1.G2(DQL6) U7.AB7(SDQ6/SDQ4)
DQ7: U1.H7(DQL7) U7.AC3(SDQ7)
DQ8: U1.D7(DQU0) U7.AB2(SDQ8/SDQ11)
DQ9: U1.C3(DQU1) U7.Y1(SDQ9/SDQ10)
DQ10: U1.C8(DQU2) U7.AC2(SDQ10/SDQ12)
DQ11: U1.C2(DQU3) U7.Y2(SDQ11/SDQ15)
DQ12: U1.A7(DQU4) U7.AA1(SDQ12/SDQ8)
DQ13: U1.A2(DQU5) U7.AB3(SDQ13/SDQ14)
DQ14: U1.B8(DQU6) U7.W2(SDQ14/SDQ13)
DQ15: U1.A3(DQU7) U7.AC1(SDQ15/SDQ9)
ECOL: RM1.2.2 U2.15(COL/CRS_DV/MODE2) U7.D13(ECOL/CAN_TX/UART1_DCD/PA16)
ECRS: U2.14(CRS) U7.E12(ECRS/UART7_RX/UART1_DSR/PA15)
EMDC: U2.17(MDC) U7.E10(EMDC/UART1_RX/PA11)
EMDIO: RM1.3.2 U2.16(MDIO) U7.D11(EMDIO/UART6_TX/UART1_RTS/PA12)
ERXCK: RM2.1.1 U2.7(RXCLK/PHYAD1) U7.D9(ERXCK/SPI3_MISO/PA8)
ERXD0: RM1.1.2 U2.11(RXD0/MODE0) U7.E6(ERXD0/SPI1_MISO/PA3)
ERXD1: RM1.4.2 U2.10(RXD1/MODE1) U7.D6(ERXD1/SPI1_MOSI/PA2)
ERXD2: RM2.3.1 U2.9(RXD2/RMIISEL) U7.E5(ERXD2/SPI1_CLK/PA1)
ERXD3: RM2.2.1 U2.8(RXD3/PHYAD2) U7.D5(ERXD3/SPI1_CS0/PA0)
ERXDV: U2.26(RXDV) U7.D10(ERXDV/UART1_TX/PA10)
ERXERR: RM2.4.1 U2.13(RXER/RXD4/PHYAD0) U7.E9(ERXERR/SPI3_CS1/PA9)
ETHERNET_VDD: C63.2 C64.2 C74.2 C76.2 L2.1 LAN.3(COM) LAN.6(NC) R80.2 R81.2 R82.2 R83.2 U2.1(VDD2A) U2.27(VDD1A)
ETXCK: U2.20(TXCLK) U7.D12(ETXCK/UART7_TX/UART1_DTR/PA14)
ETXD0: U2.22(TXD0) U7.E8(ETXD0/SPI3_MOSI/PA7)
ETXD1: U2.23(TXD1) U7.D8(ETXD1/SPI3_CLK/PA6)
ETXD2: U2.24(TXD2) U7.E7(ETXD2/SPI3_CS0/PA5)
ETXD3: U2.25(TXD3) U7.D7(ETXD3/SPI1_CS1/PA4)
ETXEN: U2.21(TXEN) U7.E11(ETXEN/UART6_RX/UART1_CTS/PA13)
ETXERR: R19.2 U2.18(NINT/TXER/TXD4) U7.C13(ETXERR/CAN_RX/UART1_RING/PA17)
EXTEN: U12.20(EXTEN) U14.4(EN) U15.1(EN)
FMINL: GPIO-4.19 U7.Y20(FMINL)
FMINR: GPIO-4.17 U7.Y21(FMINR)
GND [PWR]: 5V_SATA_PWR.2 BACKUP.2 C3.1 C4.1 C5.1 C6.1 C7.1 C8.1 C9.1 C10.1 C11.1 C12.1 C13.1 C14.1 C15.1 C16.1 C17.1 C18.1 C19.1 C20.1 C21.1 C22.1 C23.1 C24.1 C25.1 C26.1 C27.1 C28.1 C29.1 C30.1 C31.1 C32.1 C33.1 C34.1 C35.1 C36.1 C37.1 C38.1 C39.1 C40.1 C41.1 C42.1 C43.1 C44.1 C45.1 C46.1 C48.1 C49.1 C50.1 C51.1 C52.1 C53.1 C55.1 C56.1 C57.1 C58.1 C59.1 C60.1 C61.1 C62.1 C63.1 C64.1 C65.1 C66.1 C67.1 C68.1 C69.1 C70.1 C71.1 C72.1 C73.1 C74.1 C75.1 C76.1 C77.1 C78.1 C79.1 C80.1 C81.1 C85.1 C86.1 C87.1 C88.1 C89.1 C90.1 C91.1 C92.1 C93.1 C94.1 C95.1 C96.1 C98.1 C104.1 C105.1 C106.1 C107.1 C108.1 C109.2 C110.2 C111.2 C112.1 C113.1 C114.1 C115.1 C116.1 C117.2 C118.1 C119.1 C120.2 C121.1 C122.1 C123.1 C124.2 C125.1 C126.2 C130.1 C132.1 C134.2 C135.2 C136.2 C137.2 C138.1 C139.1 C140.1 C141.1 C142.2 C143.2 C144.2 C145.1 C146.2 C147.2 C148.2 C149.2 C150.1 C151.1 C152.1 C153.2 C154.1 C155.1 C156.1 C157.1 C158.2 C159.2 C160.2 C161.1 C162.2 C163.2 C164.1 C165.2 C166.2 C167.2 C168.2 C169.1 C170.2 C171.1 C172.1 C173.1 C174.- C176.2 C177.2 C178.2 C179.2 C180.1 C181.1 C182.2 C184.2 C185.2 C186.2 C187.1 C188.1 C189.1 C190.1 C191.1 C192.1 C193.1 C194.1 C201.1 C202.1 C203.1 CASE.GND1(GND) CASE.GND2(GND) CASE.GND3(GND) CASE.GND4(GND) CASE.GND5(GND) CASE.GND6(GND) CASE.GND7(GND) CASE.GND8(GND) CASE.GND9(GND) CASE.GND10(GND) CASE.GND11(GND) CASE.GND12(GND) CASE.GND13(GND) CASE.GND14(GND) CASE.GND15(GND) CASE.GND16(GND) CASE.GND17(GND) CASE.GND18(GND) CASE.GND19(GND) CASE.GND20(GND) CASE.GND21(GND) CASE.GND22(GND) CASE.GND23(GND) CASE.GND24(GND) CASE.GND25(GND) CASE.GND26(GND) CASE.GND27(GND) CASE.GND28(GND) CASE.GND29(GND) CASE.GND30(GND) CASE.GND31(GND) CASE.GND32(GND) CASE.GND33(GND) CASE.GND34(GND) CASE.GND35(GND) CASE.GND36(GND) D4.A FET4.2(S) FLASH_CONNECTOR.2(GND) FLASH_CONNECTOR.6(GND) FLASH_CONNECTOR.10(GND) FLASH_CONNECTOR.13(GND) FLASH_CONNECTOR.14(GND) FLASH_CONNECTOR.17(GND) FLASH_CONNECTOR.18(GND) FLASH_CONNECTOR.22(GND) FLASH_CONNECTOR.26(GND) FLASH_CONNECTOR.30(GND) FLASH_CONNECTOR.34(GND) FLASH_CONNECTOR.38(GND) FLASH_CONNECTOR.MP FLASH_CONNECTOR.MP1(MP) GND.1(PP) GND_PIN.P$1(PP) GPIO-1.2 GPIO-2.2 GPIO-3.2 GPIO-3.4 GPIO-4.2 HDMI.2 HDMI.5 HDMI.8 HDMI.11 HDMI.17 HDMI.SH1 HDMI.SH2 HDMI.SH3 HDMI.SH4 L6.1 L9.1 LCD_CON.2 LCD_CON.4 LED1.C LIPO_BAT.2 PWR.2_1 PWR_JACK.- PWR_JACK.-- PWR_LED.C R5.1 R6.1 R8.1 R14.1 R19.1 R29.2 R32.2 R34.2 R35.1 R36.1 R37.1 R40.1 R41.1 R47.1 R48.1 R50.1 R55.2 R57.1 R58.1 R59.1 R61.1 R63.2 R66.1(1.1) R69.2 R70.2 R72.2 R77.1 R78.1 R79.1 R84.2 R85.2 R86.2 R92.1 R99.2 RECOVERY.1_1 RM2.1.2 RM2.2.2 RM2.3.2 SATA.1(GND) SATA.4(GND) SATA.7(GND) SD/MMC1.6(VSS) T1.2(E) U1.A9(VSS) U1.B1(VSSQ) U1.B3(VSS) U1.B9(VSSQ) U1.D1(VSSQ) U1.D8(VSSQ) U1.E1(VSS) U1.E2(VSSQ) U1.E8(VSSQ) U1.F9(VSSQ) U1.G1(VSSQ) U1.G8(VSS) U1.G9(VSSQ) U1.J2(VSS) U1.J8(VSS) U1.M1(VSS) U1.M9(VSS) U1.P1(VSS) U1.P9(VSS) U1.T1(VSS) U1.T9(VSS) U2.EP1(GND1) U2.EP2(GND2) U2.EP3(GND3) U2.EP4(GND4) U2.EP5(GND5) U2.EP6(GND6) U2.EP7(GND7) U2.EP8(GND8) U2.EP9(GND9) U2.EXP_PAD(GND) U3.1(A0) U3.2(A1) U3.3(A2) U3.4(GND) U3.7(WP) U4.2(GND) U5.3(GND) U5.8(GND) U6.3(GND) U6.8(GND) U7.AA18(GND25_TVIN/VRN-TVIN) U7.G3(GND/GND_DRAM) U7.G4(GND/GND_DRAM) U7.H16(TEST) U7.J5(GND/GND_DRAM) U7.J11(GND) U7.K5(GND/GND_DRAM) U7.K11(GND) U7.K12(GND) U7.K13(GND) U7.K14(ULGND/GND) U7.L10(GND) U7.L11(GND) U7.L12(GND) U7.L13(UGND_T/GND) U7.L14(UGND_C/GND) U7.M9(GND/GND_DLL) U7.M10(GND) U7.M11(GND) U7.M12(GND) U7.M13(GND) U7.M14(GND/GND_SATA) U7.N5(GND/GND_DRAM) U7.N10(GND/GND_DLL) U7.N11(GND) U7.N12(GND) U7.N13(GND/GND_SATA) U7.N14(GND/GND_SATA) U7.P5(GND/GND_DRAM) U7.P10(GND/GND_DLL) U7.P11(GND) U7.P12(GND) U7.P13(GND/GND_HDMI) U7.P14(GND/GND_HDMI) U7.P15(PLLGND/GND) U7.R11(GND) U7.R12(GND) U7.R13(GND/GND_HDMI) U7.T11(GND) U7.T12(GND) U7.U5(GND/GND_DRAM) U7.V5(GND/GND_DRAM) U7.V19(HPGND) U7.W9(GND/GND_LVDS) U7.W10(GND/GND_LVDS) U7.W11(GND/GND_LVDS) U7.W18(GND33_TVOUT/TVOUT1) U7.Y7(GND/GND_DRAM) U7.Y8(GND/GND_DRAM) U7.Y18(GND33_TVIN/TVOUT3) U8.3(GND) U8.8(GND) U9.2(GND) U10.2(GND) U11.2(GND) U12.9(PGND2) U12.16(PGND3) U12.22(AGND) U12.46(PGND1) U12.N1(GND_PAD) U12.N2(GND_PAD) U12.N3(GND_PAD) U12.N4(GND_PAD) U12.N5(GND_PAD) U12.N6(GND_PAD) U12.N7(GND_PAD) U12.N8(GND_PAD) U12.N9(GND_PAD) U12.N10(GND_PAD) U12.N11(GND_PAD) U12.N12(GND_PAD) U12.N13(GND_PAD) U12.N14(GND_PAD) U12.N15(GND_PAD) U12.N16(GND_PAD) U12.N17(GND_PAD) U12.VSS(GND_PAD) U13.2(GND) U14.2(GND) U15.2(GND) U20.3(GND) U21.2(VSS) U22.4(GND) UART0.3 USB_HOST1.4 USB_HOST2.4 USB_OTG.GND VR1.2(VSS) WP_ENABLE.2
GNDA: C47.2 C97.1 C99.1 C100.1 C101.1 C102.1 C103.1 GPIO-1.4 R28.2 R66.2(1.2) U7.U19(AGND)
GPIO1: R53.2 R55.1 U12.18(GPIO1)
GPIO2: GPIO-4.12 U12.5(GPIO2)
GPIO3: GPIO-4.14 U12.3(GPIO3)
HCEC: HDMI.13 R98.1 U7.P23(CEC_HDMI/HCEC) U8.1(IN1) U8.10(OUT1)
HDMI_5V_SOURCE: FUSE1.2 HDMI.18
HHPD: R32.1 R97.2 U7.P22(HPD_HDMI/HHPD) U8.5(IN4) U8.6(OUT4)
HPCOM: GPIO-1.16 U7.AA19(HPCOM) U7.AA20(HPCOMFB)
HPOUTL: GPIO-1.14 U7.Y19(HPOUTL/HPL)
HPOUTR: GPIO-1.18 U7.W19(HPOUTR/HPR)
HSCL: HDMI.15 R30.1 U7.R23(SCL_HDMI/HSCL) U8.2(IN2) U8.9(OUT2)
HSDA: HDMI.16 R31.1 U7.R22(SDA_HDMI/HSDA) U8.4(IN3) U8.7(OUT3)
HTX0N: HDMI.9 U6.2(IN2) U6.9(OUT2) U7.V22(TX0N_HDMI/HTX0N)
HTX0P: HDMI.7 U6.1(IN1) U6.10(OUT1) U7.V23(TX0P_HDMI/HTX0P)
HTX1N: HDMI.6 U5.5(IN4) U5.6(OUT4) U7.U22(TX1N_HDMI/HTX1N)
HTX1P: HDMI.4 U5.4(IN3) U5.7(OUT3) U7.U23(TX1P_HDMI/HTX1P)
HTX2N: HDMI.3 U5.2(IN2) U5.9(OUT2) U7.T22(TX2N_HDMI/HTX2N)
HTX2P: HDMI.1 U5.1(IN1) U5.10(OUT1) U7.T23(TX2P_HDMI/HTX2P)
HTXCN: HDMI.12 U6.5(IN4) U6.6(OUT4) U7.W22(TXCN_HDMI/HTXCN)
HTXCP: HDMI.10 U6.4(IN3) U6.7(OUT3) U7.W23(TXCP_HDMI/HTXCP)
INT/X1: LCD_CON.37 RM9.3.2 RM10.2.2
IPSOUT: C130.2 C136.1 C144.1 C149.1 C157.2 C160.1 C176.1 C181.2 C182.1 IPSOUT.1(PP) L14.1 R56.1 RESET.1_1 U12.7(VIN2) U12.13(LDO24IN) U12.14(VIN3) U12.21(APS) U12.34(IPSOUT) U12.35(IPSOUT) U12.40(LDO3IN) U12.44(VIN1) U13.4(IN) U14.5(IN) U15.4(IN)
LCD_CLK: LCD_CON.31 U7.Y9(LCD0_CLK/SMC_VCCEN/PD24)
LCD_D0: LCD_CON.21 U7.AB15(LCD0_D0/LVDS0_VP0/PD0)
LCD_D1: LCD_CON.22 U7.AC15(LCD0_D1/LVDS0_VN0/PD1)
LCD_D2: LCD_CON.23 U7.AB14(LCD0_D2/LVDS0_VP1/PD2)
LCD_D3: LCD_CON.24 U7.AC14(LCD0_D3/LVDS0_VN1/PD3)
LCD_D4: LCD_CON.25 U7.AB13(LCD0_D4/LVDS0_VP2/PD4)
LCD_D5: LCD_CON.26 U7.AC13(LCD0_D5/LVDS0_VN2/PD5)
LCD_D6: LCD_CON.27 U7.AB12(LCD0_D6/LVDS0_VPC/PD6)
LCD_D7: LCD_CON.28 U7.AC12(LCD0_D7/LVDS0_VNC/PD7)
LCD_D8: LCD_CON.13 U7.AB11(LCD0_D8/LVDS0_VP3/PD8)
LCD_D9: LCD_CON.14 U7.AC11(LCD0_D9/LVDS0_VN3/PD9)
LCD_D10: LCD_CON.15 U7.Y15(LCD0_D10/LVDS1_VP0/PD10)
LCD_D11: LCD_CON.16 U7.AA15(LCD0_D11/LVDS1_VN0/PD11)
LCD_D12: LCD_CON.17 U7.Y14(LCD0_D12/LVDS1_VP1/PD12)
LCD_D13: LCD_CON.18 U7.AA14(LCD0_D13/LVDS1_VN1/PD13)
LCD_D14: LCD_CON.19 U7.Y13(LCD0_D14/LVDS1_VP2/PD14)
LCD_D15: LCD_CON.20 U7.AA13(LCD0_D15/LVDS1_VN2/PD15)
LCD_D16: LCD_CON.5 U7.Y12(LCD0_D16/LVDS1_VPC/PD16)
LCD_D17: LCD_CON.6 U7.AA12(LCD0_D17/LVDS1_VNC/PD17)
LCD_D18: LCD_CON.7 U7.Y11(LCD0_D18/LVDS1_VP3/PD18)
LCD_D19: LCD_CON.8 U7.AA11(LCD0_D19/LVDS1_VN3/PD19)
LCD_D20: LCD_CON.9 U7.Y10(LCD0_D20/CSI1_MCLK/PD20)
LCD_D21: LCD_CON.10 U7.AA10(LCD0_D21/SMC_VPPEN/PD21)
LCD_D22: LCD_CON.11 U7.AB10(LCD0_D22/SMC_VPPPP/PD22)
LCD_D23: LCD_CON.12 U7.AC10(LCD0_D23/SMC_DET/PD23)
LCD_DE: LCD_CON.32 U7.AA9(LCD0_DE/SMC_RST/PD25)
LCD_HSYNC: LCD_CON.29 U7.AB9(LCD0_HSYNC/SMC_SLK/PD26)
LCD_PWR: LCD_CON.35 U7.C4(LCD1_D8/ATAD4/KP_IN0/MS_D0/EINT8/CSI1_D8/PH8)
LCD_VSYNC: LCD_CON.30 U7.AC9(LCD0_VSYNC/SMC_SDA/PD27)
LDO3_2.8V [PWR]: C77.2 C159.1 GPIO-2.4 U7.F19(VCC_CSI0/VCC-PE) U12.41(LDO3)
LDO4_2.8V [PWR]: C78.2 C163.1 U7.E18(VCC_CSI1/VCC-PG) U12.11(LDO4)
LINEINL: GPIO-4.15 U7.AB20(LINEINL)
LINEINR: GPIO-4.13 U7.AB21(LINEINR)
LRADC0: C47.1 GPIO-1.6 R10.2 U7.AB23(LRADC0)
LRADC1: GPIO-1.8 U7.AB22(LRADC1)
MIC1OUTN: GPIO-4.8 U7.AC23(MIC1OUTN)
MIC1OUTP: GPIO-4.6 U7.AC22(MIC1OUTP)
MICIN1: GPIO-1.10 U7.AC20(MICIN1)
MICIN2: GPIO-4.10 U7.AC21(MICIN2)
N$1: C107.2 C108.2 U7.AC19(HPVCC/HPBP)
N$2: R14.2 U7.AA7(SZQ)
N$3: R8.2 U1.L8(ZQ)
N$4: CHGLED.A R56.2
N$5: PC3/PB8.2 R54.2
N$6: R18.2 U22.2(DO/IO1)
N$7: D2.C UART0.2
N$8: L13.1 U13.3(LX)
N$9: C145.2 U12.19(GPIO0/LDO)
N$10: D1.C R21.2
N$11: CHGLED.C U12.36(CHGLED)
N$12: R63.1 U12.27(LDO1SET)
N$13: HDMI.19 R97.1
N$14: C81.2 Q2.1 R73.2 U7.F1(CLK32K_IN)
N$15: FET3.1(G) FET4.3(D) R75.2
N$16: R78.2 U1.L9(NC)
N$17: C148.1 R54.1 R58.2 T1.1(B)
N$18: FET1.1(G) R52.2 T1.3(C)
N$19: C175.2 R68.2 R70.1 U13.5(FB)
N$20: D6.C(K) R98.2
N$21: R94.1 U22.7(/HOLD/IO3)
N$22: R20.1 U22.5(DI/IO0)
N$23: C179.1 C186.1 D5.1(C) FET2.3(D) R67.2
N$24: 5V_E_SATA.2 5V_SATA_PWR.1 C140.2 C141.2 C190.2 C202.2 FET1.3(D)
N$25: FET2.1(G) FET4.1(G) R74.2 R77.2 U20.1(RESET) U21.1(VOUT)
N$26 [PWR]: R99.1 R100.1 U7.T9(EFUSE_VDDQ/VDDQE)
N$27: FLASH_CONNECTOR.21(SPI-HOLD(IO3))
N$28: R76.1 U22.6(CLK)
N$29: R87.1 R95.1 U22.1(/CS/)
N$30: LAN.1(TD+) R80.1 U2.29(TXP) U4.5(I/O4)
N$32: LAN.7(RD+) R82.1 U2.31(RXP) U4.4(I/O3)
N$33: LAN.8(RD-) R83.1 U2.30(RXN) U4.3(I/O2)
N$38: PWR.1_1 R60.1
N$42: C171.2 U7.AA16(VRP_TVIN/VCC-TVOUT)
N$58: R29.1 SD/MMC1.10(PACK1) SD/MMC1.11(PACK2) SD/MMC1.12(PACK3) SD/MMC1.13(PACK4)
N$64: L15.1 U15.3(LX)
N$66: C183.2 R71.2 R72.1 U15.5(FB)
N$81: LAN.2(TD-) R81.1 U2.28(TXN) U4.1(I/O1)
N$87: LAN.AY U2.3(LED1/REGOFF)
N$88: LAN.AG R84.1 U2.2(LED2/NINTSEL)
N$89: LAN.KY R86.1
N$90: R79.2 U2.32(RBIAS)
N$91: C61.2 C62.2 U2.6(VDDCR)
N$94: LAN.KG R85.1
N$99: R36.2 U9.3(ISET)
N$100: C112.2 C189.2 C201.2 L5.2 R33.2 U9.1(OUT)
N$101: R41.2 U10.3(ISET)
N$106: C127.2 SATA.2(A+)
N$111: C120.1 L7.2 USB_HOST1.1
N$112: C128.2 SATA.3(A-)
N$113: C129.2 SATA.5(B-)
N$114: C131.2 SATA.6(B+)
N$116: C85.2 Q2.4 R73.1 U7.F2(CLK32K_OUT)
N$119: R57.2 U7.V21(REXT_SATA)
N$120: R59.2 U12.23(BIAS)
N$122: C102.2 C103.2 U7.W21(VRP)
N$123: D5.2(A) L14.2 U14.1(LX)
N$125: R50.2 U12.37(TS)
N$126: R67.1 R69.1 U14.3(FB)
N$127: L10.1 U12.45(LX1)
N$128: C133.1 C134.1 L10.2 R51.1 U12.43(CHSENSE)
N$129: PWR_LED.A R65.2
N$130: L11.1 U12.8(LX2)
N$131: L12.1 U12.15(LX3)
N$132: C154.2 U12.24(VREF)
N$133: C99.2 U7.W20(VRA1)
N$137: R48.2 U11.3(ISET)
N$139: C161.2 R60.2 U12.47(PWRON)
N$140: R61.2 RESET.2_1 U12.4(N_OE)
N$176: C100.2 C101.2 R28.1 U7.V20(VRA2)
N$190: R34.1 U7.T10(JTAG_SEL)
N$192: C118.2 C187.2 C191.2 C193.2 L7.1 U10.1(OUT)
N$193: L9.2 USB_HOST1.P$3 USB_HOST1.P$4 USB_HOST2.P$3 USB_HOST2.P$4
N$194: C126.1 L8.2 USB_HOST2.1
N$195: C125.2 C188.2 C192.2 C194.2 L8.1 U11.1(OUT)
N$223: C173.2 U7.Y16(VRN_TVIN/VCC-TVIN)
N$229: LCD_CON.33 R38.1
N$230: LCD_CON.34 R39.1
N$231: LED1.A R1.2
N$266: L6.2 USB_OTG.GND1 USB_OTG.GND2 USB_OTG.GND3 USB_OTG.GND4
NALE/SPI0_MISO: FLASH_CONNECTOR.25(SPI-MISO(IO1)) FLASH_CONNECTOR.37(NAND-ALE) R18.1 U7.M22(NALE/SPI0_MISO/PC1)
NCE0: FLASH_CONNECTOR.33(NAND-CE0) U7.K23(NCE0/PC4)
NCLE/SPI0_SCK: FLASH_CONNECTOR.15(SPI-SCLK(CLK)) FLASH_CONNECTOR.35(NAND-CLE) R76.2 U7.L23(NCLE/SPI0_CLK/PC2)
NDQ0/SDC2_D0: FLASH_CONNECTOR.40(EMMC(NAND)-D0) U7.H23(NDQ0/SDC2_D0/PC8)
NDQ1/SDC2_D1: FLASH_CONNECTOR.36(EMMC(NAND)-D1) U7.H22(NDQ1/SDC2_D1/PC9)
NDQ2/SDC2_D2: FLASH_CONNECTOR.32(EMMC(NAND)-D2) U7.G23(NDQ2/SDC2_D2/PC10)
NDQ3/SDC2_D3: FLASH_CONNECTOR.28(EMMC(NAND)-D3) U7.G22(NDQ3/SDC2_D3/PC11)
NDQ4/SDC2_D4: FLASH_CONNECTOR.24(EMMC(NAND)-D4) U7.H21(NDQ4/PC12)
NDQ5/SDC2_D5: FLASH_CONNECTOR.20(EMMC(NAND)-D5) U7.H20(NDQ5/PC13)
NDQ6/SDC2_D6: FLASH_CONNECTOR.16(EMMC(NAND)-D6) U7.G21(NDQ6/PC14)
NDQ7/SDC2_D7: FLASH_CONNECTOR.12(EMMC(NAND)-D7) U7.G20(NDQ7/PC15)
NMI_N: GPIO-4.4 R21.1 U7.F5(NMI#) U12.48(IRQ/WAKEUP)
NRB0/SDC2_CMD: FLASH_CONNECTOR.9(EMMC-CMD) FLASH_CONNECTOR.29(NAND-RB0) U7.J23(NRB0/SDC2_CMD/PC6)
NRE: FLASH_CONNECTOR.31(NAND-RE) U7.K22(NRE#/PC5)
NRST: C55.2 R22.2 R24.2 R25.2 U2.19(NRST)
NWE/SPI0_MOSI: FLASH_CONNECTOR.19(SPI-MOSI(IO0)) FLASH_CONNECTOR.39(NAND-WE) R20.2 U7.M23(NWE#/SPI0_MOSI/PC0)
ODT0: R13.2 U7.AA5(ODT0/SODT)
ODT1: U1.J1(NC) U7.J3(ODT1/SCK1B)
PB2/PWM0: LCD_CON.36 U7.A14(PWM0/PB2)
PB3: GPIO-3.6 R38.2 U7.B14(IR0_TX/SPDIF_MCLK/STANBYWFI/PB3)
PB4: GPIO-3.8 R39.2 U7.A13(IR0_RX/PB4)
PB5: GPIO-3.10 U7.B13(I2S_MCLK/AC97_MCLK/PB5)
PB6: GPIO-3.12 U7.A12(I2S_BCLK/AC97_BCLK/PB6)
PB7: GPIO-3.14 U7.B12(I2S_LRCK/AC97_SYNC/PB7)
PB8/SATA-PWR-EN: GPIO-3.16 PC3/PB8.1 U7.A11(I2S_DO0/AC97_DO/PB8)
PB9/USB0-DRV: PB9/PH7_GPIO.1 PB9/PH7_USB.3 U7.C12(I2S_DO1/PB9)
PB10: GPIO-3.18 U7.C11(I2S_DO2/PB10)
PB11: GPIO-3.20 U7.C10(I2S_DO3/PB11)
PB12: GPIO-3.22 U7.C9(I2S_DI/AC97_DI/SPDIF_DI/PB12)
PB13/CTP_RES: GPIO-3.24 RM10.4.1 U7.B11(SPI2_CS1/SPDIF_DO/PB13)
PB14: GPIO-3.26 RM5.1.1 U7.A10(JTAG_MS0/SPI2_CS0/PB14)
PB15: GPIO-3.28 RM5.2.1 U7.B10(JTAG_CK0/SPI2_CLK/PB15)
PB16: GPIO-3.30 U7.A9(JTAG_DO0/SPI2_MOSI/PB16)
PB17: GPIO-3.32 RM5.4.1 U7.B9(JTAG_DI0/SPI2_MISO/PB17)
PB18/TWI1-SCK: GPIO-1.36 R15.2 R46.1 U3.6(SCL) U7.A8(TWI1_SCK/PB18)
PB19/TWI1-SDA: GPIO-1.34 R16.1 R45.1 U3.5(SDA) U7.B8(TWI1_SDA/PB19)
PB20/TWI2_SCK: GPIO-1.32 R44.1 RM10.1.1 U7.C8(TWI2_SCK/PB20)
PB21/TWI2_SDA: GPIO-1.30 R43.1 RM10.3.1 U7.C7(TWI2_SDA/PB21)
PC3/SATA-PWR-EN: GPIO-1.29 PC3/PB8.3 U7.L22(NCE1/PC3)
PC7/SDC2_CLK: FLASH_CONNECTOR.4(EMMC-CLK) GPIO-4.16 U7.J22(NRB1/SDC2_CLK/PC7)
PC16/NWP/SDC2_RST: FLASH_CONNECTOR.11(EMMC-RST) GPIO-4.18 U7.M21(NWP/PC16)
PC17: GPIO-4.20 U7.F23(NCE2/PC17)
PC18: GPIO-1.31 U7.F22(NCE3/PC18)
PC19: GPIO-1.33 U7.L21(NCE4/SPI2_CS0/PC19)
PC20: GPIO-1.35 U7.K21(NCE5/SPI2_CLK/PC20)
PC21: GPIO-1.37 U7.J21(NCE6/SPI2_MOSI/PC21)
PC22: GPIO-1.39 U7.J20(NCE7/SPI2_MISO/PC22)
PC23/SPI0_CS0: FLASH_CONNECTOR.27(SPI-CSN(CMD)) GPIO-1.40 R87.2 U7.G19(SPI0_CS0/PC23)
PC24: GPIO-1.38 U7.F21(NDQS/PC24)
PE0: GPIO-2.6 U7.E23(TS0_CLK/CSI0_PCLK/PE0)
PE1 [PWR]: GPIO-2.8 U7.E22(TS0_ERR/CSI0_MCLK/PE1)
PE2: GPIO-2.10 U7.D23(TS0_SYNC/CSI0_HSYNC/PE2)
PE3 [PWR]: GPIO-2.12 U7.D22(TS0_DVLD/CSI0_VSYNC/PE3)
PE4: GPIO-2.14 U7.C23(TS0_D0/CSI0_D0/PE4)
PE5: GPIO-2.16 U7.C22(TS0_D1/CSI0_D1/PE5)
PE6: GPIO-2.18 U7.B23(TS0_D2/CSI0_D2/PE6)
PE7: GPIO-2.20 U7.B22(TS0_D3/CSI0_D3/PE7)
PE8: GPIO-2.22 U7.A23(TS0_D4/CSI0_D4/PE8)
PE9: GPIO-2.24 U7.A22(TS0_D5/CSI0_D5/PE9)
PE10: GPIO-2.26 U7.B21(TS0_D6/CSI0_D6/PE10)
PE11: GPIO-2.28 U7.A21(TS0_D7/CSI0_D7/PE11)
PG0: GPIO-1.5 U7.F20(TS1_CLK/CSI1_PCLK/SDC1_CMD/PG0)
PG1: GPIO-1.7 U7.E21(TS1_ERR/CSI1_MLCK/SDC1_CLK/PG1)
PG2: GPIO-1.9 U7.E20(TS1_SYNC/CSI1_HSYNC/SDC1_D0/PG2)
PG3: GPIO-1.11 U7.D21(TS1_DVLD/CSI1_VSYNC/SDC1_D1/PG3)
PG4: GPIO-1.13 U7.D20(TS1_D0/CSI1_D0/SDC1_D2/CSI0_D8/PG4)
PG5: GPIO-1.15 U7.C21(TS1_D1/CSI1_D1/SDC1_D3/CSI0_D9/PG5)
PG6: GPIO-1.17 U7.E19(TS1_D2/CSI1_D2/UART3_TX/CSI0_D10/PG6)
PG7: GPIO-1.19 U7.C20(TS1_D3/CSI1_D3/UART3_RX/CSI0_D11/PG7)
PG8: GPIO-1.21 U7.D19(TS1_D4/CSI1_D4/UART3_RTS/CSI0_D12/PG8)
PG9: GPIO-1.23 R17.2 U7.C19(TS1_D5/CSI1_D5/UART3_CTS/CSI0_D13/PG9)
PG10: GPIO-1.25 U7.D18(TS1_D6/CSI1_D6/UART4_TX/CSI0_D14/PG10)
PG11: GPIO-1.27 U7.C18(TS1_D7/CSI1_D7/UART4_RX/CSI0_D15/PG11)
PH0: GPIO-3.7 U7.A6(LCD1_D0/ATAA0/UART3_TX/EINT0/CSI1_D0/PH0)
PH2/LED: R1.1 U7.C6(LCD1_D2/ATAA2/UART3_RTS/EINT2/CSI1_D2/PH2)
PH7/PB9: GPIO-3.9 PB9/PH7_GPIO.2
PH7/USB0-DRV: PB9/PH7_GPIO.3 PB9/PH7_USB.1 U7.B4(LCD1_D7/ATAD3/UART5_RX/MS_CLK/EINT7/CSI1_D7/PH7)
PH9/CAN_CTRL: GPIO-3.11 U7.D4(LCD1_D9/ATAD5/KP_IN1/MS_D1/EINT9/CSI1_D9/PH9)
PH10/EPHY-RST#: GPIO-3.13 R24.1 U7.A3(LCD1_D10/ATAD6/KP_IN2/MS_D2/EINT10/CSI1_D10/PH10)
PH11: GPIO-3.15 U7.B3(LCD1_D11/ATAD7/KP_IN3/MS_D3/EINT11/CSI1_D11/PH11)
PH12/CTP_INT: GPIO-3.17 RM10.2.1 U7.C3(LCD1_D12/ATAD8/PS2_SCK1/EINT12/CSI1_D12/PH12)
PH13 [PWR]: GPIO-3.19 U7.A2(LCD1_D13/ATAD9/PS2_SDA1/SMC_RST/EINT13/CSI1_D13/PH13)
PH14: GPIO-3.21 U7.B2(LCD1_D14/ATAD10/KP_IN4/SMC_VPPEN/EINT14/CSI1_D14/PH14)
PH15 [PWR]: GPIO-3.23 U7.A1(LCD1_D15/ATAD11/KP_IN5/SMC_VPPPP/EINT15/CSI1_D15/PH15)
PH16: GPIO-3.25 U7.B1(LCD1_D16/ATAD12/KP_IN6/SMC_DET/EINT16/CSI1_D16/PH16)
PH17: GPIO-3.27 U7.C1(LCD1_D17/ATAD13/KP_IN7/SMC_VCCEN/EINT17/CSI1_D17/PH17)
PH18: GPIO-3.29 U7.C2(LCD1_D18/ATAD14/KP_OUT0/SMC_SLK/EINT18/CSI1_D18/PH18)
PH19: GPIO-3.31 U7.D1(LCD1_D19/ATAD15/KP_OUT1/SMC_SDA/EINT19/CSI1_D19/PH19)
PH20: GPIO-3.33 U7.D2(LCD1_D20/ATAOE/CAN_TX/EINT20/CSI1_D20/PH20)
PH21: GPIO-3.35 U7.D3(LCD1_D21/ATADREQ/CAN_RX/EINT21/CSI1_D21/PH21)
PH22: GPIO-3.37 U7.E1(LCD1_D22/ATADACK/KP_OUT2/SDC1_CMD/CSI1_D22/PH22)
PH23: GPIO-3.39 U7.E2(LCD1_D23/ATACS0/KP_OUT3/SDC1_CLK/CSI1_D23/PH23)
PH24: GPIO-3.34 U7.E3(LCD1_CLK/ATACS1/KP_OUT4/SDC1_D0/CSI1_PCLK/PH24)
PH25: GPIO-3.36 U7.E4(LCD1_DE/ATAIORDY/KP_OUT5/SDC1_D1/CSI1_FIELD/PH25)
PH26: GPIO-3.38 U7.F3(LCD1_HSYNC/ATAIOR/KP_OUT6/SDC1_D2/CSI1_HSYNC/PH26)
PH27: GPIO-3.40 U7.F4(LCD1_VSYNC/ATAIOW/KP_OUT7/SDC1_D3/CSI1_VSYNC/PH27)
PI0: GPIO-2.9 U7.A20(PI0)
PI1: GPIO-2.11 U7.B20(PI1)
PI2: GPIO-2.13 U7.A19(PI2)
PI3: GPIO-2.15 U7.B19(PWM1/PI3)
PI4: GPIO-2.17 U7.A18(SDC3_CMD/PI4)
PI5: GPIO-2.19 U7.B18(SDC3_CLK/PI5)
PI6: GPIO-2.21 U7.A17(SDC3_D0/PI6)
PI7: GPIO-2.23 U7.B17(SDC3_D1/PI7)
PI8: GPIO-2.25 U7.A16(SDC3_D2/PI8)
PI9: GPIO-2.27 U7.B16(SDC3_D3/PI9)
PI10: GPIO-2.29 U7.C17(SPI0_CS0/UART5_TX/EINT22/PI10)
PI11: GPIO-2.31 U7.D17(SPI0_CLK/UART5_RX/EINT23/PI11)
PI12: GPIO-2.33 U7.C16(SPI0_MOSI/UART6_TX/EINT24/PI12)
PI13: GPIO-2.35 U7.D16(SPI0_MISO/UART6_RX/EINT25/PI13)
PI14: GPIO-2.37 U7.C15(PS2_SCK1/TCLKIN0/EINT26/SPI0_CS1/PI14)
PI15: GPIO-2.39 U7.D15(PS2_SDA1/TCLKIN1/EINT27/SPI1_CS1/PI15)
PI16: GPIO-2.40 U7.E17(EINT28/SPI1_CS0/UART2_RTS/PI16)
PI17: GPIO-2.38 U7.E16(EINT29/SPI1_CLK/UART2_CTS/PI17)
PI18: GPIO-2.36 U7.E15(EINT30/SPI1_MOSI/UART2_TX/PI18)
PI19: GPIO-2.34 U7.D14(EINT31/SPI1_MISO/UART2_RX/PI19)
PI20: GPIO-2.32 U7.E14(HSCL/UART7_TX/PS2_SCK0/PI20)
PI21: GPIO-2.30 U7.E13(HSDA/UART7_RX/PS2_SDA0/PI21)
RASN: U1.J3(#RAS) U7.T4(SRAS)
RES/X2: LCD_CON.38 RM9.1.2 RM10.4.2
RESET_N: C79.2 C80.2 GPIO-3.5 R22.1 R23.1 U7.C14(RESET#) U12.25(PWROK)
SA0: U1.N3(A0) U7.W4(SA0)
SA1: U1.P7(A1) U7.R4(SA1)
SA2: U1.P3(A2) U7.U4(SA2)
SA3: U1.N2(A3) U7.M4(SA3)
SA4: U1.P8(A4) U7.Y4(SA4)
SA5: U1.P2(A5) U7.N4(SA5)
SA6: U1.R8(A6) U7.V4(SA6)
SA7: U1.R2(A7) U7.M3(SA7)
SA8: U1.T8(A8) U7.AA3(SA8)
SA9: U1.R3(A9) U7.P4(SA9)
SA10: U1.L7(A10/AP) U7.L3(SA10)
SA11: U1.R7(A11) U7.W3(SA11)
SA12: U1.N7(A12/#BC) U7.P3(SA12)
SA13: U1.T3(A13) U7.Y3(SA13)
SA14: U1.T7(NC/A14) U7.R3(SA14)
SATA-RXM: C129.1 U7.U20(RXM_SATA)
SATA-RXP: C131.1 U7.U21(RXP_SATA)
SATA-TXM: C128.1 U7.T21(TXM_SATA)
SATA-TXP: C127.1 U7.T20(TXP_SATA)
SCK: R9.2 U7.V1(SCK)
SCK#: R11.2 U7.V2(SCK#/SCKB)
SCKE1: U1.J9(NC) U7.J4(SCKE1)
SCL/Y1: LCD_CON.39 RM9.4.2 RM10.1.2
SCS0: U1.L2(#CS) U7.V3(SCS0/SCS)
SCS1: U1.L1(NC) U7.AA4(SCS1)
SD0-CLK: SD/MMC1.5(CLK/SCLK) U7.L20(SDC0_CLK/UART0_TX/PF2)
SD0-CMD: R27.1 SD/MMC1.3(CMD/DI) U7.L19(SDC0_CMD/JTAG_DO1/PF3)
SD0-D0: RM4.2.2 SD/MMC1.7(DAT0/DO) U7.M19(SDC0_D0/JTAG_DI1/PF1)
SD0-D1: RM4.3.2 SD/MMC1.8(DAT1/RES) U7.M20(SDC0_D1/JTAG_MS1/PF0)
SD0-D2: RM4.1.2 SD/MMC1.1(DAT2/RES) U7.K19(SDC0_D2/JTAG_CK1/PF5)
SD0-D3: R26.1 SD/MMC1.2(CD/DAT3/CS) U7.K20(SDC0_D3/UART0_RX/PF4)
SD0-DET#: RM4.4.2 SD/MMC1.9(CP_E) U7.B6(LCD1_D1/ATAA1/UART3_RX/EINT1/CSI1_D1/PH1)
SD_VCC: C96.2 C98.2 L4.2 SD/MMC1.4(VDD)
SDA/Y2: LCD_CON.40 RM9.2.2 RM10.3.2
SDQM0: U1.E7(DML) U7.AC6(SDQM0)
SDQM1: U1.D3(DMU) U7.W1(SDQM1)
SDQS0: U1.F3(DQSL) U7.AB6(SDQS0)
SDQS0_N: U1.G3(#DQSL) U7.AC5(SDQS0#/SDQS0B)
SDQS1: U1.C7(DQSU) U7.AB1(SDQS1)
SDQS1_N: U1.B7(#DQSU) U7.AA2(SDQS1#/SDQS1B)
SRST: R12.2 U7.AA6(SRST)
TPX1: C113.2 RM9.3.1 U7.Y22(XP_TP/TPX1)
TPX2: C114.2 RM9.1.1 U7.AA22(XN_TP/TPX2)
TPY1: C115.2 RM9.4.1 U7.Y23(YP_TP/TPY1)
TPY2: C116.2 RM9.2.1 U7.AA23(YN_TP/TPY2)
TVIN0: GPIO-4.5 U7.AC18(TVIN0/GND)
TVIN1: GPIO-4.7 U7.AB18(TVIN1/GND)
TVIN2: GPIO-4.9 U7.AA17(TVIN2/VCC25-TVIN)
TVIN3: GPIO-4.11 U7.Y17(TVIN3/GND)
TVOUT3: GPIO-4.3 U7.AB17(TVOUT3/TVIN3)
TWI0-SCK: GPIO-2.5 R62.1 U7.A15(TWI0_SCK/PB0) U12.2(SCK)
TWI0-SDA: GPIO-2.7 R64.1 U7.B15(TWI0_SDA/PB1) U12.1(SDA)
UART0-RX: D2.A GPIO-1.26 R49.1 U7.B7(UART0_RX/IR1_RX/PB23)
UART0-TX: GPIO-1.28 U7.A7(UART0_TX/IR1_TX/PB22) UART0.1
UBOOT_SEL: RECOVERY.2_1 U7.W8(UBOOT_SEL)
UDM0: U7.N20(DM0) USB_OTG.D-
UDM1: U7.P20(DM1) USB_HOST1.2
UDM2: U7.R20(DM2) USB_HOST2.2
UDP0: U7.N21(DP0) USB_OTG.D+
UDP1: U7.P21(DP1) USB_HOST1.3
UDP2: U7.R21(DP2) USB_HOST2.3
USB0-DRV: PB9/PH7_USB.2 R35.2 U9.4(EN) U12.6(N_VBUSEN)
USB0-IDDET: R42.2 U7.B5(LCD1_D4/ATAD0/UART4_TX/EINT4/CSI1_D4/PH4) USB_OTG.ID
USB0-VBUSDET: C109.1 R33.1 R37.2 U7.C5(LCD1_D5/ATAD1/UART4_RX/EINT5/CSI1_D5/PH5)
USB1-DRV [PWR]: R40.2 U7.A4(LCD1_D6/ATAD2/UART5_TX/MS_BS/EINT6/CSI1_D6/PH6) U10.4(EN)
USB2-DRV [PWR]: R47.2 U7.A5(LCD1_D3/ATAIRQ/UART3_CTS/EINT3/CSI1_D3/PH3) U11.4(EN)
V+: 1.5V.1(PP) C1.1 C2.1 C3.2 C4.2 C5.2 C6.2 C7.2 C8.2 C9.2 C10.2 C11.2 C12.2 C19.2 C20.2 C21.2 C22.2 C23.2 C24.2 C25.2 C26.2 C27.2 C38.2 C39.2 C40.2 C41.2 C42.2 C43.2 C44.2 C45.2 C46.2 C175.1 C177.1 C178.1 L13.2 R2.2 R3.2 R7.2 R68.1 U1.A1(VDDQ) U1.A8(VDDQ) U1.B2(VDD) U1.C1(VDDQ) U1.C9(VDDQ) U1.D2(VDDQ) U1.D9(VDD) U1.E9(VDDQ) U1.F1(VDDQ) U1.G7(VDD) U1.H2(VDDQ) U1.H9(VDDQ) U1.K2(VDD) U1.K8(VDD) U1.N1(VDD) U1.N9(VDD) U1.R1(VDD) U1.R9(VDD) U7.G5(VCC_DRAM) U7.H5(VCC_DRAM) U7.L5(VCC_DRAM) U7.M5(VCC_DRAM) U7.R5(VCC_DRAM) U7.T5(VCC_DRAM) U7.W5(VCC_DRAM) U7.W6(VCC_DRAM) U7.W7(VCC_DRAM) U7.Y6(VCC_DRAM) ; supply symbol labelled 1.5V
VCC [PWR]: 3.3V.1(PP) C56.2 C57.2 C58.2 C60.2 C65.2 C66.2 C67.2 C68.2 C69.2 C70.2 C71.2 C72.2 C73.2 C75.2 C94.2 C95.2 C104.2 C105.2 C106.2 C119.2 C121.2 C137.1 C139.2 C165.1 C168.1 C169.2 C170.1 C172.2 C183.1 C184.1 C185.1 C203.2 D1.A D6.A FLASH_CONNECTOR.1(VCCF(3.3V)) FLASH_CONNECTOR.3(VCCF(3.3V)) FLASH_CONNECTOR.5(VCCQ(3.3/1.8V)) FLASH_CONNECTOR.7(VCCQ(3.3/1.8V)) GPIO-1.3 GPIO-2.3 GPIO-3.3 GPIO-4.1 L2.2 L4.1 L15.2 LCD_CON.3 R15.1 R16.2 R23.2 R25.1 R26.2 R27.2 R42.1 R43.2 R44.2 R45.2 R46.2 R49.2 R62.2 R64.2 R71.1 R93.1 R94.2 R95.2 RM1.1.1 RM1.2.1 RM1.3.1 RM1.4.1 RM2.4.2 RM4.1.1 RM4.2.1 RM4.3.1 RM4.4.1 RM5.1.2 RM5.2.2 RM5.4.2 U2.12(VDDIO) U3.8(VCC) U7.AB19(HPVCCIN/VCCHP) U7.H8(VCC) U7.H9(VCC) U7.H10(VCC-PA/VCC) U7.H15(VCC) U7.H19(VCC-PC/VCC_NAND) U7.J8(VCC) U7.J9(VCC) U7.J10(VCC-PA/VCC) U7.J14(VCC) U7.J19(VCC-PC/VCC_NAND) U7.L15(UVCC_T/VCC-USB) U7.L16(UVCC_C/VCC-USB) U7.N19(VCC_CARD/VCC-PF) U7.P16(PLLVP25/VCC-PLL) U7.T13(VP_HDMI/VCC-HDMI) U7.W12(VCC_LVDS) U7.W13(VCC_LVDS) U7.W14(VCC_LVDS) U7.W15(VCC33_TVOUT/TVOUT0) U7.W16(VCC33_TVIN/TVOUT2) U22.8(VCC) VR1.1(VIN) VR1.3(CE) ; supply symbol labelled 3.3V
VCC/2: 1.2V_CPU.1(PP) C48.2 C49.2 C50.2 C51.2 C52.2 C53.2 C142.1 C143.1 L11.2 U7.H11(VDD_CPU) U7.H12(VDD_CPU) U7.H13(VDD_CPU) U7.H14(VDD_CPU) U7.J12(VDD_CPU) U7.J13(VDD_CPU) U12.10(DCDC2) ; supply symbol labelled 1.2V_CPU
VCCINT: 1.2V_INT.1(PP) C15.2 C16.2 C17.2 C18.2 C28.2 C29.2 C30.2 C31.2 C32.2 C33.2 C34.2 C35.2 C36.2 C37.2 C122.2 C123.2 C146.1 C147.1 C155.2 C156.2 L12.2 U7.J15(VDD-SYS/VDD_INT) U7.J16(VDD-SYS/VDD_INT) U7.K9(VDD-SYS/VDD_INT) U7.K10(VDD-SYS/VDD_INT) U7.K15(VDD-SYS/VDD_INT) U7.K16(ULVDD/VDD-USB) U7.L8(VDD-SYS/VDD_INT) U7.L9(VDD-SYS/VDD_INT) U7.M8(VDD_DLL) U7.M15(VDD12_SATA) U7.M16(VDD12_SATA) U7.N9(VDD_DLL) U7.P9(VDD_DLL) U7.R9(VDD-SYS/VDD_INT) U7.R10(VDD-SYS/VDD_INT) U7.T8(VDD-SYS/VDD_INT) U12.17(DCDC3) ; supply symbol labelled 1.2V_INT
VDD: 2.5V.1(PP) C151.2 C152.2 C162.1 C164.2 C166.1 C167.1 R100.2 U7.N15(VDD25_SATA) U7.N16(VDD25_SATA) U7.W17(VDD25_TVIN/VRP-TVIN) VR1.5(VOUT) ; supply symbol labelled 2.5V
VDD_RTC: C92.2 C93.2 C153.1 U7.K8(RTC_VDD) U12.28(LDO1)
VGA-B: GPIO-1.22 U7.AB16(TVOUT1/VGA-B/TVIN1)
VGA-G: GPIO-1.20 U7.AC16(TVOUT0/VGA-G/TVIN0)
VGA-R: GPIO-1.24 U7.AC17(TVOUT2/VGA-R/TVIN2)
VINT: C150.2 U12.26(VINT)
VMIC: GPIO-1.12 U7.AA21(VMIC)
VPP [PWR]: 3.0VA.1(PP) C97.2 C158.1 R10.1 U7.T19(AVCC) U12.12(LDO2) U13.1(EN) ; supply symbol labelled 3.0VA
WEN: U1.L3(#WE) U7.T3(SWE)
WP: FLASH_CONNECTOR.23(SPI-WPN(IO2)) R17.1 R92.2 R93.2 U22.3(/WP/IO2) WP_ENABLE.1
XTALI: C90.2 Q3.2 U7.N23(CLK24M_IN)
XTALI2: C86.2 Q1.2 U2.4(XTAL2)
XTALO: C91.2 Q3.1 U7.N22(CLK24M_OUT)
XTALO2: C87.2 Q1.1 U2.5(XTAL1/CLKIN)
Unconnected: FLASH_CONNECTOR.8(EMMC-DS) HDMI.14 RM5.3.1 RM5.3.2 U1.M7(NC) U7.G1(SDQM3) U7.G2(SDQ30/SDQ29) U7.H1(SDQ25/SDQ26) U7.H2(SDQ27/SDQ31) U7.J1(SDQ28/SDQ24) U7.J2(SDQS3#/SDQS3B) U7.K1(SDQS3/SDQS3) U7.K2(SDQ31/SDQ27) U7.L1(SDQ24/SDQ25) U7.L2(SDQ26/SDQ28) U7.M1(SDQ29/SQD30) U7.M2(SDQ23) U7.N1(SDQ16/SDQ22) U7.N2(SDQ18/SDQ17) U7.N8(ADBG/SADBG) U7.P1(SDQ21/SDQ19) U7.P2(SDQS2#/SDQS2B) U7.P8(SDBG0/SDDBG0) U7.P19(CLKM_SATA) U7.R1(SDQS2) U7.R2(SDQM2) U7.R8(SDBG1/SADBG1) U7.R14(VREGIO2_HDMI/NC) U7.R15(PLLVREG) U7.R16(PLLREGIO/NC) U7.R19(CLKP_SATA) U7.T1(SDQ22/SDQ20) U7.T2(SDQ17/SDQ16) U7.T14(VREGIO1_HDMI/HVREG1) U7.T15(PLLTEST) U7.T16(PLLDV) U7.U1(SDQ19/SDQ21) U7.U2(SDQ20/SDQ18) U12.29(DC3SET) U14.6(NC)

## Buses
SA[0..14]
DQ[0..31]
BA[0..2],CLK,CLKN,CKE,CASN,RASN,WEN,SDQM[0..3],SDQS[0..3],SDQS0_N,SDQS1_N,SDQS2_N,SDQS3_N,DDR3_RST,DDR3_ODT,SCS0,SCS1,SCKE1,ODT1
LCD_D[0..7],LCD_D[8..15],LCD_D[16..23],LCD_HSYNC,LCD_VSYNC,LCD_CLK,LCD_DE
ETXD[0..3],ETXEN,ETXCK,ERXD[0..3],ERXDV,ERXCK,ERXERR,EMDC,EMDIO,ECOL,ECRS,EPHY-RST#
SATA-TXP,SATA-TXM,SATA-RXM,SATA-RXP
HTX0P,HTX0N,HTX1P,HTX1N,HTX2P,HTX2N,HTXCP,HTXCN,HSCL,HSDA,HHPD,HCEC

## Notes on the sheet
- 1 x [4Gb DDR3 SDRAM (256Mx16)]
- LED
- Button
- We have used a number of fully compatible
- but different DDR3 memories due to supply unavailability.
- In such cases the memory part name
- in the schematic might remain outdated.
- It is recommended to always refer to the
- exact memory name printed on the component itself.
- The PHY is setted up as follows:
- Ethernet | MODE: All capable(10/100Base).
- MAC Address
- Auto-negotiation enabled.
- MII Configuration
- EEPROM
- SMI address: 0x01
- 16 Kbit
- (2048x8)
- I2C Address: 0xA0
- MicroSD | HDMI
- LCD EXTENSION | GPIO EXTENSION
- 5.0V | GND
- 3.3V | GND
- R0 | R1
- R2 | R3
- R4 | R5
- R6 | R7
- G0 | G1
- G2 | G3
- G4 | G5
- G6 | G7
- B0 | B1 | USB-OTG
- B2 | B3
- B4 | B5
- B6 | B7
- HSYNC | VSYNC
- CLK | DE
- L/R | U/D
- PWRE | BKL
- INT/X1 | RES/X2
- SCL/Y1 | SDA/Y2
- Rs
- Iset = 6800/Rs
- Iset = 523mA
- USB-HOSTs
- Rs
- Iset = 6800/Rs
- Iset = 1000mA
- Rs
- Iset = 6800/Rs
- Iset = 523mA
- SATA | POWER SUPPLY CIRCUIT
- 1V2/1.6A
- +
- -
- 1V2/1.2A
- 1V3/30mA
- 3V/200mA
- 2V8/200mA
- 2V8/200mA
- Must be Floating!!!
- 5VDC Only!!!
- EMMC, SPI FLASH, NAND
- 128M-BIT SERIAL FLASH MEMORY
- Present in -sXMB
- +
- -
- LI-ION_BATTERY
- Rc
- Rd
- Vout=0.6x(1+Rc/Rd)
- Re
- Rf
- Vout=0.6x(1+Re/Rf)

## Library data of the parts
1.2V_CPU 1.2V_INT 1.5V 2.5V 3.0VA 3.3V 5VEXT +5V BAT GND GND_PIN IPSOUT = gogo:TESTPAD: drill 40mils, diameter 70mils
5V_E 5V_E_SATA WP_ENABLE = jumper:SJ: SMD solder JUMPER
5V_SATA_PWR BACKUP LIPO_BAT = Penko:CON2
C1-C53 C55-C81 C85-C173 C175-C194 C201-C203 = rcl:C-EU: CAPACITOR, European symbol
C174 = rcl:CPOL-EU: POLARIZED CAPACITOR, European symbol
CASE = OLIMEX_CASES:CASE_HAMMOND_1593LBK
CHGLED LED1 PWR_LED = DOUBLE-SIDE:LED
D1-D3 = gogo:SCHOTKKY7.62SS
D4 = OLIMEX_DISCRET:SMBJ16A
D5 = semicon-smd-ipc:D-: DIODE unfilled
D6 = DOUBLE-SIDE:D: DIODES
FET1-FET3 = Penko:P-MOS+DIOD
FET4 = Penko:N-MOS+DIOD
FLASH_CONNECTOR = OLIMEX_CONNECTORS:FLASH_CON[DF12(3.0)-40DS-0.5V(86)]
FUSE1 = gogo:FUSE
GPIO-1-GPIO-3 LCD_CON = OLIMEX_CASES:ML40: HARTING
GPIO-4 = con-harting-ml:ML20: HARTING
HDMI = OLIMEX_CONNECTORS:HDMI-MC34931
L2 L4-L9 = rcl:L-US: INDUCTOR, American symbol
L10-L15 = OLIMEX_DISCRET:L
LAN = OLIMEX_CONNECTORS:RJLBC-060TC1_GND
PB9/PH7_GPIO PB9/PH7_USB PC3/PB8 = jumper:SJ2W: SMD solder JUMPER
PWR RECOVERY RESET = gogo:SW-TAKT
PWR_JACK = gogo:PWR-JAK
Q1 Q3 = crystal:HC49/S: CRYSTAL
Q2 = crystal:MC-306
R1-R65 R67-R87 R92-R95 R97-R100 = rcl:R-EU_: RESISTOR, European symbol
R66 = OLIMEX_DISCRET:R_0R
RM1 RM2 RM4 RM5 RM9 RM10 = OLIMEX_DISCRET:R_MATRIX_4E
SATA = OLIMEX_CONNECTORS:SATA-PWA-07
SD/MMC1 = OLIMEX_CONNECTORS:MICRO_SD/MMC_CP_NEW
T1 = semicon-smd-ipc:NPN-TRANSISTOR_: NPN TRANSISTOR
U1 = OLIMEX_IC:H5TQ2G63BFR_MEM4G16D3EABG-125
U2 = OLIMEX_IC:LAN8710A: LAN8710A/LAN8710Ai Small Footprint MII/RMII 10/100 Ethernet Transceiver with HP Auto-MDIX and flexPWR® Technology
U3 = gogo:24LCXX
U4 = OLIMEX_IC:ESDS314DBVR
U5 U6 U8 = OLIMEX_IC:RCLAMP0524P
U7 = OLIMEX_IC:A10
U9-U11 = OLIMEX_IC:SY6280
U12 = OLIMEX_IC:AXP209
U13 U15 = OLIMEX_IC:SY8008
U14 = OLIMEX_IC:SY7208
U16-U19 = SparkFunEagle-6-6-07:FIDUCIAL: Fiducial Alignment Points Various fiducial points for machine vision alignment.
U20 = gogo:RESET: Microcontroller Supervisory Circuit with Open Drain Output
U21 = OLIMEX_IC:VDA2710NTA
U22 = OLIMEX_IC:W25Q16BVSSIG
UART0 = Penko:CON3
USB_HOST1 USB_HOST2 = OLIMEX_CONNECTORS:USB_SHIELD
USB_OTG = OLIMEX_CONNECTORS:MINI_USB9
VR1 = OLIMEX_DISCRET:AP1231